# EAGLE board padaukprog (EAGLE 6.4), part 1 of 2
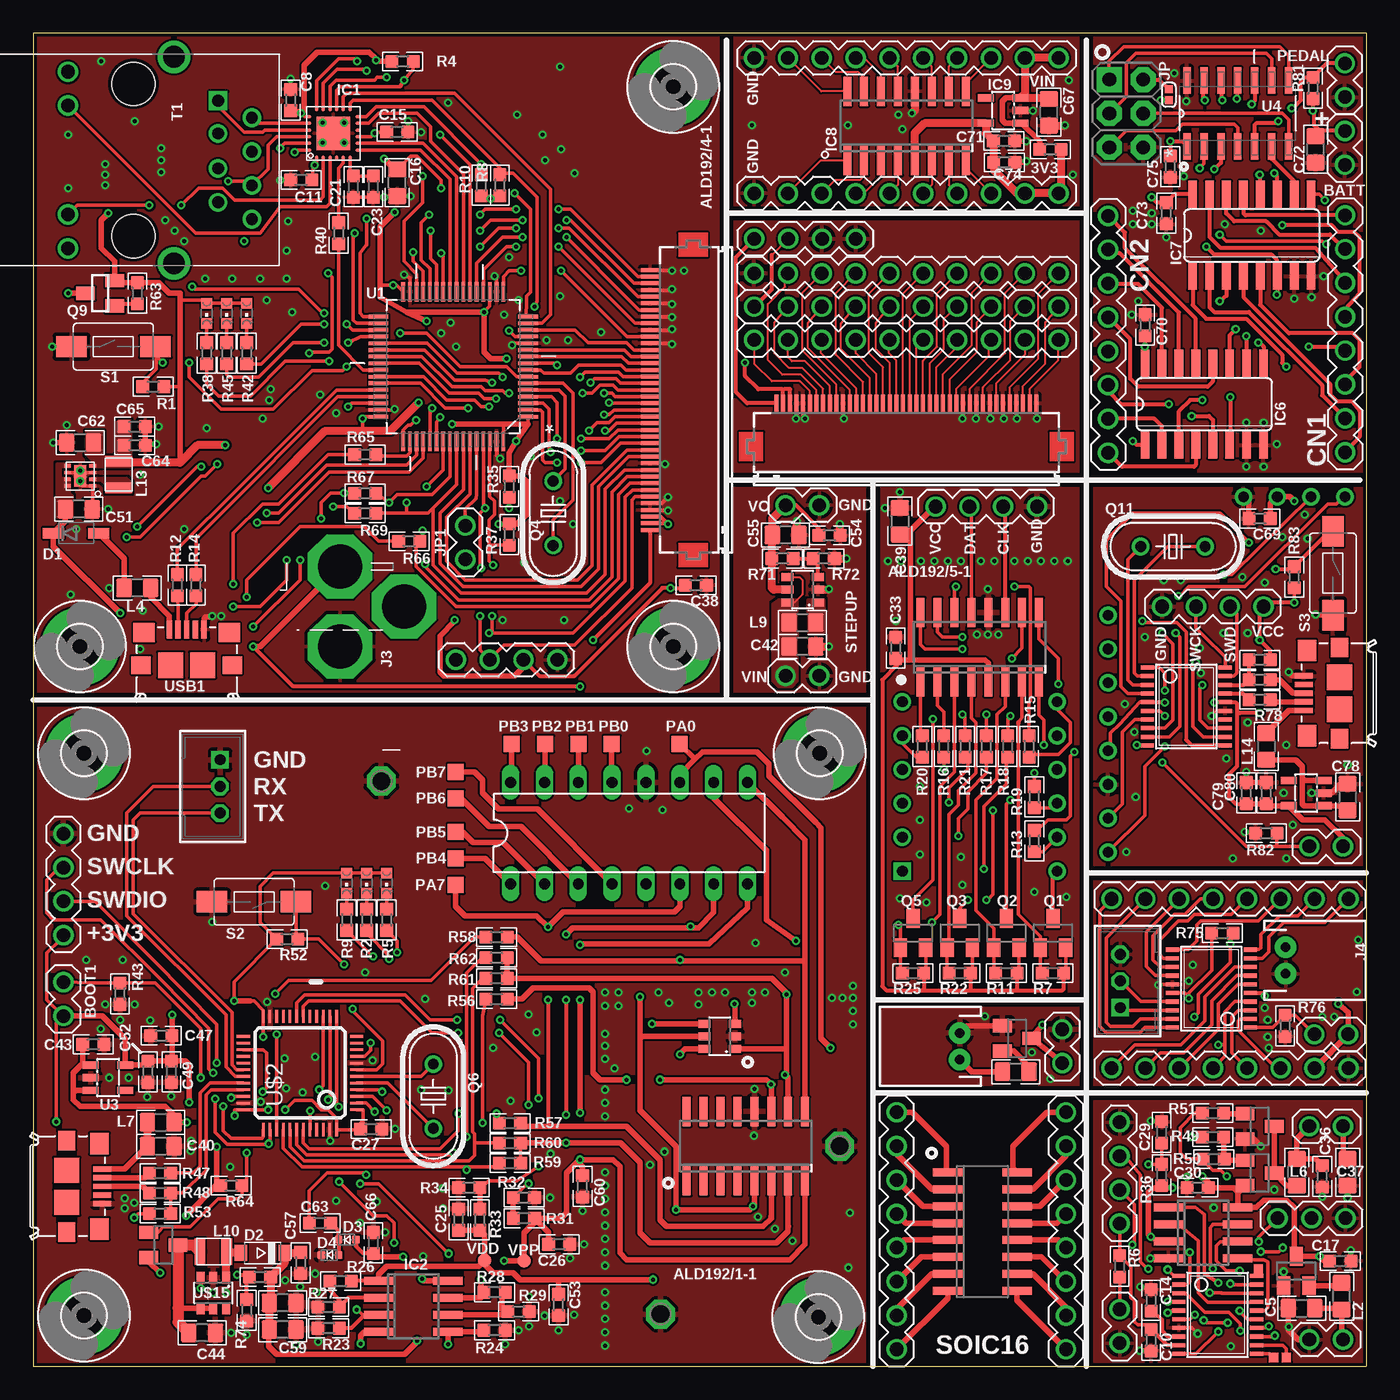
[diagram p8: board, top side]
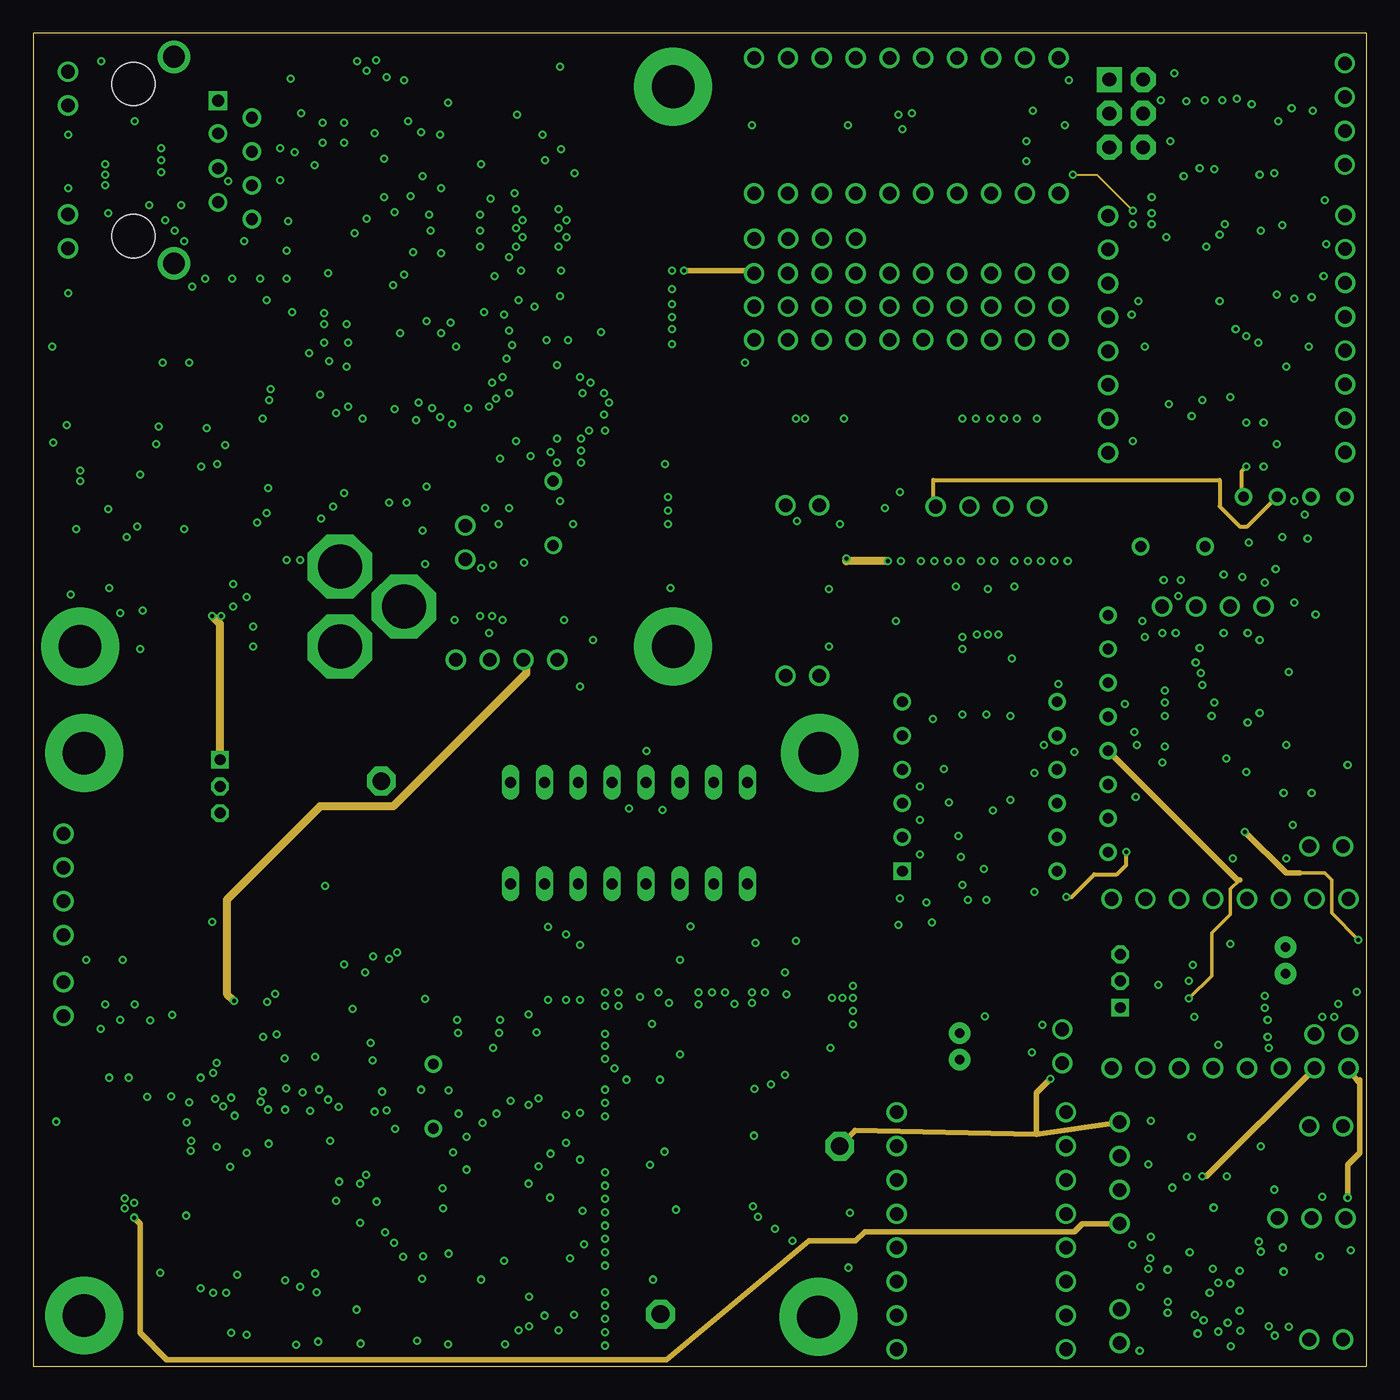
[diagram p9: board, inner layer Dummy]
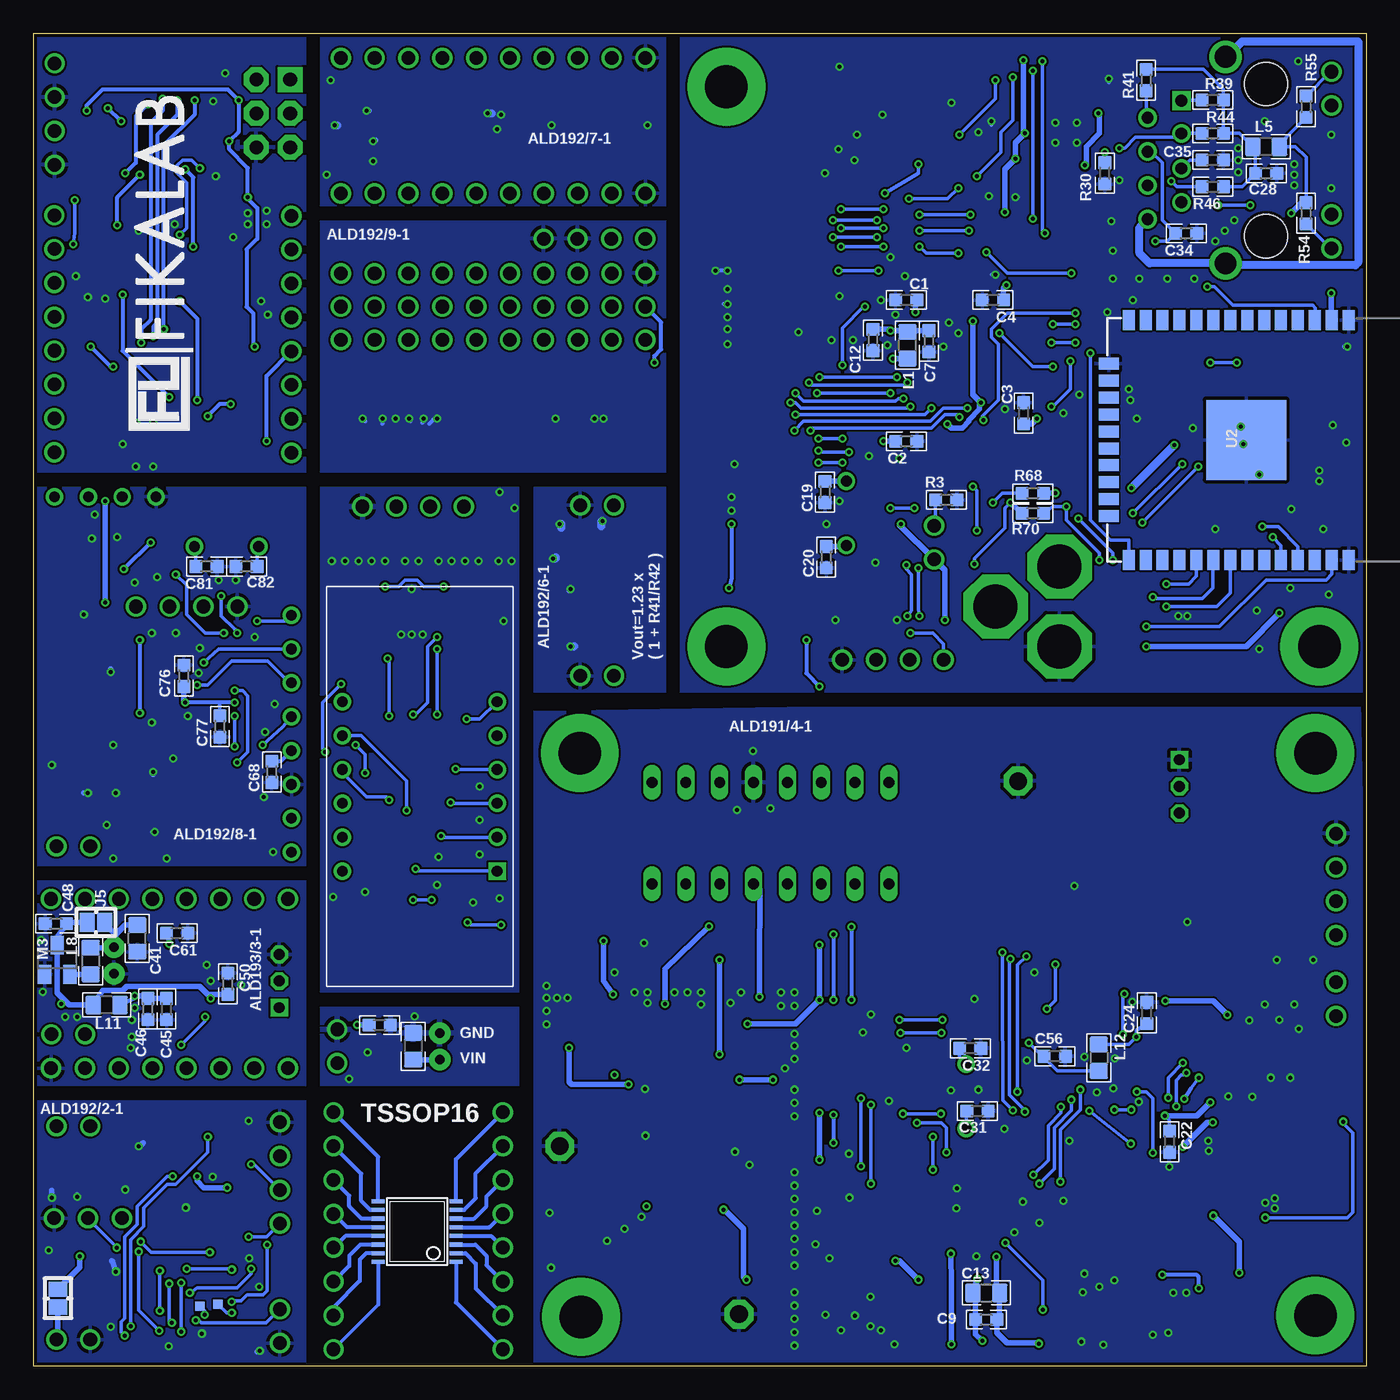
[diagram p10: board, bottom side, seen from below]

Size 100 x 100 mm. Coordinates in mm from the lower left corner, seen from the top.
Outline: 0,0 100,0 100,100 0,100 0,0
Copper layers (1*2*16): Top 0.035mm / dielectric 1.5mm / Dummy 0.0175mm / dielectric 1.1mm / Bottom 0.035mm
Design rules "JLCPCB-Single-DualLayer *": minimum track width 5mil, minimum drill 0.3mm, track to track 6mil, track to pad 6mil, pad to pad 6mil, via to via 6mil, smd to smd 0mil, copper to edge 10mil, drill to drill 10mil, minimum pad ring 10mil, minimum via ring 6mil, stop-mask expansion 2mil, vias tented up to drill 100mil, thermal gap 10mil
Net classes: 1 power: width 0.254 mm, drill 0.25 mm
tRestrict: area 62.5,0 to 63.5,67; area 63.5,20 to 100,21; area 78.5,0 to 79.5,21; area 78.5,21 to 79.5,100; area 79.5,36.5 to 108.5,37.5; area 0,49.5 to 63,50.5; area 49.5,50 to 50.5,50.5; area 62.5,66 to 100,67; area 63,27 to 78.5,28; area 52,86 to 78.5,87; area 51.5,50.5 to 52.5,100; area 52.5,66 to 62.5,67
bRestrict: area 62.5,0 to 63.5,67; area 63.5,20 to 100,21; area 78.5,0 to 79.5,20; area 78.5,21 to 79.5,100; area 79.5,36.5 to 108.5,37.5; area 0,49.5 to 63,50.5; area 49.5,50 to 50.5,50.5; area 62.5,66 to 100,67; area 63.5,27 to 78.5,28; area 52,86 to 78.5,87; area 51.5,50.5 to 52.5,100; area 52.5,66 to 62.5,67

## Footprints (pad centres in the part's own frame; a part is rotated, then mirrored left to right if it is on the bottom)
PIN-1X2 = drill 1.016: 1 -1.27,0; 2 1.27,0
0603 = smd 1 x 1: 1 -0.8,0; 2 0.8,0
0805 = smd 1.2 x 1.4: 1 -1,0; 2 1,0
SOD-123 = smd 1.6 x 0.8: 1 -1.7,0; 2 1.7,0
SOD-123' = smd 0.91 x 1.22: A 1.635,0; C -1.635,0
SOD523 = smd 0.6 x 0.6: A 0.7,0; K -0.6,0
3,2-PAD = drill 3.2 pad 5.842: B3,2 0,0
QFN24_4MM_X_4MM = smd 0.4 x 0.25: 1 -1.86,1.25; 2 -1.86,0.75; 3 -1.86,0.25; 4 -1.86,-0.25; 5 -1.86,-0.75; 6 -1.86,-1.25; 13 1.86,-1.25; 14 1.86,-0.75; 15 1.86,-0.25; 16 1.86,0.25; 17 1.86,0.75; 18 1.86,1.25 | smd 0.25 x 0.4: 7 -1.25,-1.86; 8 -0.75,-1.86; 9 -0.25,-1.86; 10 0.25,-1.86; 11 0.75,-1.86; 12 1.25,-1.86; 19 1.25,1.86; 20 0.75,1.86; 21 0.25,1.86; 22 -0.25,1.86; 23 -0.75,1.86; 24 -1.25,1.86 | smd 2.5 x 2.5: P 0,0
SO08 = smd 0.6 x 2.2: 1 -1.905,-2.6; 2 -0.635,-2.6; 3 0.635,-2.6; 4 1.905,-2.6; 5 1.905,2.6; 6 0.635,2.6; 7 -0.635,2.6; 8 -1.905,2.6
SOIC-16 = smd 0.6 x 2.2: 1 -4.445,-2.6; 2 -3.175,-2.6; 3 -1.905,-2.6; 4 -0.635,-2.6; 5 0.635,-2.6; 6 1.905,-2.6; 7 3.175,-2.6; 8 4.445,-2.6; 9 4.445,2.6; 10 3.175,2.6; 11 1.905,2.6; 12 0.635,2.6; 13 -0.635,2.6; 14 -1.905,2.6; 15 -3.175,2.6; 16 -4.445,2.6
WSON8-2.1X2.1 = smd 0.5 x 0.25: 1 -0.95,0.75; 2 -0.95,0.25; 3 -0.95,-0.25; 4 -0.95,-0.75; 5 0.95,-0.75; 6 0.95,-0.25; 7 0.95,0.25; 8 0.95,0.75 | smd 0.9 x 1.6: EXP 0,0
DIL16 = drill 0.813 long: 1 -8.89,-3.81; 2 -6.35,-3.81; 3 -3.81,-3.81; 4 -1.27,-3.81; 5 1.27,-3.81; 6 3.81,-3.81; 7 6.35,-3.81; 8 8.89,-3.81; 9 8.89,3.81; 10 6.35,3.81; 11 3.81,3.81; 12 1.27,3.81; 13 -1.27,3.81; 14 -3.81,3.81; 15 -6.35,3.81; 16 -8.89,3.81
SO16 = smd 0.66 x 2.032: 1 -4.445,-3.073; 2 -3.175,-3.073; 3 -1.905,-3.073; 4 -0.635,-3.073; 5 0.635,-3.073; 6 1.905,-3.073; 7 3.175,-3.073; 8 4.445,-3.073; 9 4.445,3.073; 10 3.175,3.073; 11 1.905,3.073; 12 0.635,3.073; 13 -0.635,3.073; 14 -1.905,3.073; 15 -3.175,3.073; 16 -4.445,3.073
SOIC16-N = smd 0.6 x 2.2: 1 -4.44,-2.645; 2 -3.17,-2.645; 3 -1.9,-2.645; 4 -0.63,-2.645; 5 0.64,-2.645; 6 1.91,-2.645; 7 3.18,-2.645; 8 4.45,-2.645; 9 4.45,2.555; 10 3.18,2.555; 11 1.91,2.555; 12 0.64,2.555; 13 -0.63,2.555; 14 -1.9,2.555; 15 -3.17,2.555; 16 -4.44,2.555
SOT23-5L = smd 0.55 x 1.2: 1 -0.95,-1.3; 2 0,-1.3; 3 0.95,-1.3; 4 0.95,1.3; 5 -0.95,1.3
JST-2-PTH@1 = drill 0.7 pad 1.6: 1 -1,0; 2 1,0
JUMPER_SOLDER_1X2 = smd 1.143 x 1.422: 1 -0.66,0; 2 0.66,0
SPC4078-NOSLOT = drill 3.302 pad 4.826 octagon: 1 -3,0; 2 0,-4.8; 3 3,0
2X3-NS = drill 1.016 pad 1.88 square: 1 -2.54,-1.27 | drill 1.016 pad 1.88 octagon: 2 -2.54,1.27; 3 0,-1.27; 4 0,1.27; 5 2.54,-1.27; 6 2.54,1.27
PIN-1X3 = drill 1.016: 1 -2.54,0; 2 0,0; 3 2.54,0
PIN-1X8 = drill 1.016: 1 -8.89,0; 2 -6.35,0; 3 -3.81,0; 4 -1.27,0; 5 1.27,0; 6 3.81,0; 7 6.35,0; 8 8.89,0
L2520 = smd 0.8 x 2: P$1 -1,0; P$2 1,0
LED-603 = smd 0.8 x 0.8: A 0,-0.75; C 0,0.75
SOT23 = smd 1 x 1.4: 1 -0.95,-1.1; 2 0.95,-1.1; 3 0,1.1
B3B-PH-K = drill 0.813 square: 1 -2,0 | drill 0.813 octagon: 2 0,0; 3 2,0
HC49U-V = drill 0.813: 1 -2.413,0; 2 2.413,0
SUPER-SOT3 = smd 1 x 1.4: 1 -0.95,-1.1; 2 0.95,-1.1; 3 0,1.1
TACTILE-SWITCH-1101NE = smd 2.3 x 1.6: P$1 -3.15,0; P$2 3.15,0
SJ_2S_SMALL = smd 0.6 x 0.6: 1 -0.4,0; 2 0.4,0
HR13550A = drill 0.89 square: 1 4.45,-6.35 | drill 0.89: 2 3.18,-8.89; 3 2,-6.35; 4 0.64,-8.89; 5 -0.63,-6.35; 6 -1.9,-8.89; 7 -3.17,-6.35; 8 -4.44,-8.89 | drill 1.02: 9 6.625,4.9; 10 4.085,4.9; 11 -4.085,4.9; 12 -6.625,4.9 | drill 1.63: Z1 -7.745,-3.05; Z2 7.745,-3.05 | hole 3.25: -5.715,0; 5.715,0
P1-13 = drill 1.321 pad 2.159 octagon: TP 0,0
TP07SQ = smd 0.7 x 0.7: TP 0,0
TP12SQ = smd 1.2 x 1.2: TP 0,0
QFP50P1200X1200X160-64N = smd 1.473 x 0.279: 1 -5.613,3.759; 2 -5.613,3.251; 3 -5.613,2.743; 4 -5.613,2.261; 5 -5.613,1.753; 6 -5.613,1.245; 7 -5.613,0.762; 8 -5.613,0.254; 9 -5.613,-0.254; 10 -5.613,-0.762; 11 -5.613,-1.245; 12 -5.613,-1.753; 13 -5.613,-2.261; 14 -5.613,-2.743; 15 -5.613,-3.251; 16 -5.613,-3.759; 33 5.613,-3.759; 34 5.613,-3.251; 35 5.613,-2.743; 36 5.613,-2.261; 37 5.613,-1.753; 38 5.613,-1.245; 39 5.613,-0.762; 40 5.613,-0.254; 41 5.613,0.254; 42 5.613,0.762; 43 5.613,1.245; 44 5.613,1.753; 45 5.613,2.261; 46 5.613,2.743; 47 5.613,3.251; 48 5.613,3.759 | smd 0.279 x 1.473: 17 -3.759,-5.613; 18 -3.251,-5.613; 19 -2.743,-5.613; 20 -2.261,-5.613; 21 -1.753,-5.613; 22 -1.245,-5.613; 23 -0.762,-5.613; 24 -0.254,-5.613; 25 0.254,-5.613; 26 0.762,-5.613; 27 1.245,-5.613; 28 1.753,-5.613; 29 2.261,-5.613; 30 2.743,-5.613; 31 3.251,-5.613; 32 3.759,-5.613; 49 3.759,5.613; 50 3.251,5.613; 51 2.743,5.613; 52 2.261,5.613; 53 1.753,5.613; 54 1.245,5.613; 55 0.762,5.613; 56 0.254,5.613; 57 -0.254,5.613; 58 -0.762,5.613; 59 -1.245,5.613; 60 -1.753,5.613; 61 -2.261,5.613; 62 -2.743,5.613; 63 -3.251,5.613; 64 -3.759,5.613
ESP-WROOM-32 = smd 0.9 x 1.5: 1 7.7,9; 2 6.43,9; 3 5.16,9; 4 3.89,9; 5 2.62,9; 6 1.35,9; 7 0.08,9; 8 -1.19,9; 9 -2.46,9; 10 -3.73,9; 11 -5,9; 12 -6.27,9; 13 -7.54,9; 14 -8.81,9; 25 -8.81,-9; 26 -7.54,-9; 27 -6.27,-9; 28 -5,-9; 29 -3.73,-9; 30 -2.46,-9; 31 -1.19,-9; 32 0.08,-9; 33 1.35,-9; 34 2.62,-9; 35 3.89,-9; 36 5.16,-9; 37 6.43,-9; 38 7.7,-9 | smd 1.5 x 0.9: 15 -10.3,5.715; 16 -10.3,4.445; 17 -10.3,3.175; 18 -10.3,1.905; 19 -10.3,0.635; 20 -10.3,-0.635; 21 -10.3,-1.905; 22 -10.3,-3.175; 23 -10.3,-4.445; 24 -10.3,-5.715 | smd 6 x 6: GND 0,0
SOIC127P600X175-14N = smd 1.981 x 0.559: 1 -2.464,3.81; 2 -2.464,2.54; 3 -2.464,1.27; 4 -2.464,0; 5 -2.464,-1.27; 6 -2.464,-2.54; 7 -2.464,-3.81; 8 2.464,-3.81; 9 2.464,-2.54; 10 2.464,-1.27; 11 2.464,0; 12 2.464,1.27; 13 2.464,2.54; 14 2.464,3.81
PIN-1X4 = drill 1.016: 1 -3.81,0; 2 -1.27,0; 3 1.27,0; 4 3.81,0
LQFP48 = smd 0.2 x 1: 1 -2.75,-4.25; 2 -2.25,-4.25; 3 -1.75,-4.25; 4 -1.25,-4.25; 5 -0.75,-4.25; 6 -0.25,-4.25; 7 0.25,-4.25; 8 0.75,-4.25; 9 1.25,-4.25; 10 1.75,-4.25; 11 2.25,-4.25; 12 2.75,-4.25; 25 2.75,4.25; 26 2.25,4.25; 27 1.75,4.25; 28 1.25,4.25; 29 0.75,4.25; 30 0.25,4.25; 31 -0.25,4.25; 32 -0.75,4.25; 33 -1.25,4.25; 34 -1.75,4.25; 35 -2.25,4.25; 36 -2.75,4.25 | smd 1 x 0.2: 13 4.25,-2.75; 14 4.25,-2.25; 15 4.25,-1.75; 16 4.25,-1.25; 17 4.25,-0.75; 18 4.25,-0.25; 19 4.25,0.25; 20 4.25,0.75; 21 4.25,1.25; 22 4.25,1.75; 23 4.25,2.25; 24 4.25,2.75; 37 -4.25,2.75; 38 -4.25,2.25; 39 -4.25,1.75; 40 -4.25,1.25; 41 -4.25,0.75; 42 -4.25,0.25; 43 -4.25,-0.25; 44 -4.25,-0.75; 45 -4.25,-1.25; 46 -4.25,-1.75; 47 -4.25,-2.25; 48 -4.25,-2.75
LCD_7SEG_4DIGIT = drill 0.8 square: 1 -6.35,-5.8 | drill 0.8: 2 -3.81,-5.8; 3 -1.27,-5.8; 4 1.27,-5.8; 5 3.81,-5.8; 6 6.35,-5.8; 7 6.35,5.8; 8 3.81,5.8; 9 1.27,5.8; 10 -1.27,5.8; 11 -3.81,5.8; 12 -6.35,5.8
TSSOP20 = smd 0.305 x 0.991: 1 -2.925,-2.918; 2 -2.275,-2.918; 3 -1.625,-2.918; 4 -0.975,-2.918; 5 -0.325,-2.918; 6 0.325,-2.918; 7 0.975,-2.918; 8 1.625,-2.918; 9 2.275,-2.918; 10 2.925,-2.918; 11 2.925,2.918; 12 2.275,2.918; 13 1.625,2.918; 14 0.975,2.918; 15 0.325,2.918; 16 -0.325,2.918; 17 -0.975,2.918; 18 -1.625,2.918; 19 -2.275,2.918; 20 -2.925,2.918
SOIC8 = smd 0.6 x 2.2: 1 -1.905,-2.6; 2 -0.635,-2.6; 3 0.635,-2.6; 4 1.905,-2.6; 5 1.905,2.6; 6 0.635,2.6; 7 -0.635,2.6; 8 -1.905,2.6
TSSOP16 = smd 0.305 x 0.991: 1 -2.275,-2.918; 2 -1.625,-2.918; 3 -0.975,-2.918; 4 -0.325,-2.918; 5 0.325,-2.918; 6 0.975,-2.918; 7 1.625,-2.918; 8 2.275,-2.918; 9 2.275,2.918; 10 1.625,2.918; 11 0.975,2.918; 12 0.325,2.918; 13 -0.325,2.918; 14 -0.975,2.918; 15 -1.625,2.918; 16 -2.275,2.918
SOT23-6 = smd 0.6 x 0.9: 1 -0.95,-1.15; 2 0,-1.15; 3 0.95,-1.15; 4 0.95,1.15; 5 0,1.15; 6 -0.95,1.15
PIN-1X10 = drill 1.016: 1 -11.43,0; 2 -8.89,0; 3 -6.35,0; 4 -3.81,0; 5 -1.27,0; 6 1.27,0; 7 3.81,0; 8 6.35,0; 9 8.89,0; 10 11.43,0
HW-147-NFC-NOHOLES = drill 0.8: GND 6.35,13.97; GND1 -15.24,3.81; IRQ 8.89,13.97; MISO -3.81,13.97; MOSI -1.27,13.97; RSTO 11.43,13.97; SCK -6.35,13.97; SCL/RX -15.24,-3.81; SDA/TX -15.24,-1.27; SS 1.27,13.97; VCC 3.81,13.97; VCC1 -15.24,1.27
CONN_USB_MICRO-B = smd 1.6 x 1.4: BODY@1 -3.2,2.45; BODY@2 3.2,2.45 | smd 1.45 x 1.3: BODY@3 3.425,0; BODY@6 -3.425,0 | smd 1.9 x 1.9: BODY@4 1.2,0; BODY@5 -1.2,0 | smd 0.4 x 1.35: P1 -1.3,2.675; P2 -0.65,2.675; P3 0,2.675; P4 0.65,2.675; P5 1.3,2.675
TP10R = smd 1 x 1: TP 0,0
FH12-40S-0.5SH = smd 0.3 x 1.3: 1 -9.75,3.25; 2 -9.25,3.25; 3 -8.75,3.25; 4 -8.25,3.25; 5 -7.75,3.25; 6 -7.25,3.25; 7 -6.75,3.25; 8 -6.25,3.25; 9 -5.75,3.25; 10 -5.25,3.25; 11 -4.75,3.25; 12 -4.25,3.25; 13 -3.75,3.25; 14 -3.25,3.25; 15 -2.75,3.25; 16 -2.25,3.25; 17 -1.75,3.25; 18 -1.25,3.25; 19 -0.75,3.25; 20 -0.25,3.25; 21 0.25,3.25; 22 0.75,3.25; 23 1.25,3.25; 24 1.75,3.25; 25 2.25,3.25; 26 2.75,3.25; 27 3.25,3.25; 28 3.75,3.25; 29 4.25,3.25; 30 4.75,3.25; 31 5.25,3.25; 32 5.75,3.25; 33 6.25,3.25; 34 6.75,3.25; 35 7.25,3.25; 36 7.75,3.25; 37 8.25,3.25; 38 8.75,3.25; 39 9.25,3.25; 40 9.75,3.25

## Placement (x,y rotation side)
BOOT1  PIN-1X2  [PIN-1X2]  2.25,27.55 270 top
BOOT2  PIN-1X2  [PIN-1X2]  97,39 0 top
C1  100nF 6.3V  [0603]  34.5,80 180 bottom
C2  100nF 6.3V  [0603]  34.5,69.4 0 bottom
C3  100nF 6.3V  [0603]  25.7,71.5 90 bottom
C4  100nF 6.3V  [0603]  28,80 180 bottom
C5  22uF 16V  [0805]  95.15,4.35 0 top
C6  22uF 16V  [0805]  71.5,24 270 bottom
C7  100nF 6.3V  [0603]  32.8,76.9 270 bottom
C8  100nF  [0603]  19.3,95 270 top
C9  100nF 50V  [0603]  28.5,3.5 0 bottom
C10  100nF  [0603]  83.85,1.95 90 top
C11  100nF  [0603]  20.1,89 0 top
C12  10uF  [0603]  37,77 90 bottom
C13  2.2uF 50V  [0805]  28.5,5.5 0 bottom
C14  2.2uF  [0603]  83.85,4.95 270 top
C15  100nF  [0603]  27.3,92.6 180 top
C16  2.2uF  [0805]  27.3,88.8 90 top
C17  10uF  [0603]  98.05,7.9 180 top
C18  10uF  [0603]  74,25.6 180 bottom
C19  16pF 6.3V  [0603]  40.6,65.6 90 bottom
C20  16pF 6.3V  [0603]  40.5,60.7 90 bottom
C21  1uF  [0603]  24,88.5 90 top
C22  100nF 6.3V  [0603]  14.75,16.85 270 bottom
C23  1nF  [0603]  25.5,88.5 90 top
C24  100nF 6.3V  [0603]  16.45,26.5 90 bottom
C25  100nF 50V  [0603]  31.9,11 90 top
C26  100nF 50V  [0603]  39.45,9.15 0 top
C27  100nF 6.3V  [0603]  25.35,17.8 0 top
C28  100nF/DNP  [0603]  7.5,89.5 180 bottom
C29  100nF  [0603]  84.65,17.55 270 top
C30  100nF  [0603]  87.35,13.4 0 top
C31  20pF 6.3V  [0603]  29.15,19.15 180 bottom
C32  20pF 6.3V  [0603]  29.7,23.85 180 bottom
C33  100nF  [0603]  64.7,53.9 270 top
C34  100nF  [0603]  13.5,85 0 bottom
C35  100nF  [0603]  11.5,90.5 0 bottom
C36  1uF  [0603]  96.7,14.25 90 top
C37  10uF  [0805]  98.6,14.55 90 top
C38  10uF  [0603]  49.7,58.6 180 top
C39  22uF  [0805]  65,63.4 270 top
C40  22uF  [0805]  9.55,16.5 180 top
C41  22uF 16V  [0805]  92.2,32.1 90 bottom
C42  10uF  [0805]  57.7,54 180 top
C43  10uF 6.3V  [0603]  4.5,24.15 0 top
C44  22uF 16V  [0805]  12.65,2.5 180 top
C45  100nF  [0603]  90,26.8 90 bottom
C46  1uF  [0603]  91.4,26.8 90 bottom
C47  100nF 6.3V  [0603]  9.6,24.8 180 top
C48  10uF  [0603]  98.3,33.2 0 bottom
C49  10uF 6.3V  [0603]  10.35,22.1 270 top
C50  100nF  [0603]  85.4,28.7 270 bottom
C51  10uF  [0805]  3.4,64.3 180 top
C52  10uF 6.3V  [0603]  8.6,22.1 270 top
C53  100nF 50V  [0603]  39.4,4.6 270 top
C54  100nF  [0603]  59.74,62.34 180 top
C55  10uF  [0805]  56.44,62.36 180 top
C56  100nF 6.3V  [0603]  23.35,23.25 0 bottom
C57  100nF 50V  [0603]  20.05,7.75 270 top
C58  22uF 50V  [0805]  18.7,4.75 180 top
C59  22uF 50V  [0805]  18.7,2.75 180 top
C60  100nF 50V  [0603]  41.2,13.5 270 top
C61  1uF  [0603]  89.2,32.5 180 bottom
C62  10uF  [0805]  3.5,69.3 0 top
C63  100nF 50V  [0603]  21.5,10.75 0 top
C64  100nF  [0603]  7.6,69.1 180 top
C65  10nF  [0603]  7.6,70.5 180 top
C66  100nF 50V  [0603]  25.5,9.25 90 top
C67  22uF  [0805]  76.2,94.08 90 top
C68  100nF  [0603]  82.1,44.6 90 bottom
C69  100nF  [0603]  92,63.6 0 top
C70  100nF  [0603]  83.4,78.1 90 top
C71  100nF  [0603]  72.83,91.93 180 top
C72  10uF  [0805]  96.2,91.3 90 top
C73  100nF  [0603]  85,86.5 270 top
C74  100nF  [0603]  72.84,90.33 180 top
C75  100nF  [0603]  85.3,90 270 top
C76  100nF  [0603]  88.7,51.8 270 bottom
C77  100nF  [0603]  86,48 90 bottom
C78  10uF  [0805]  98.6,42.7 270 top
C79  10nF  [0603]  91,43 270 top
C80  100nF  [0603]  92.5,43 270 top
C81  20pF 6.3V  [0603]  87,60 180 bottom
C82  20pF 6.3V  [0603]  84,60 0 bottom
D1  1N4148W  [SOD-123]  3.2,62.5 0 top
D2  2SS100L-W  [SOD-123']  17.2,8.5 180 top
D3  RB521S-30  [SOD523]  23.5,9.5 0 top
D4  RB521S-30  [SOD523]  22.2,8.35 0 top
H1  MOUNT-PAD-ROUND3.2  [3,2-PAD]  3.5,54 0 top
H2  MOUNT-PAD-ROUND3.2  [3,2-PAD]  48,96 0 top
H3  MOUNT-PAD-ROUND3.2  [3,2-PAD]  48,54 0 top
H4  MOUNT-PAD-ROUND3.2  [3,2-PAD]  59,46 0 top
H5  MOUNT-PAD-ROUND3.2  [3,2-PAD]  58.9,3.7 0 top
H6  MOUNT-PAD-ROUND3.2  [3,2-PAD]  3.8,46 0 top
H7  MOUNT-PAD-ROUND3.2  [3,2-PAD]  3.8,3.8 0 top
IC1  LAN8720A  [QFN24_4MM_X_4MM]  22.5,92.5 90 top
IC2  LM358D  [SO08]  28.5,4.5 270 top
IC3  IC_DIL16-SOIC-16  [SOIC-16]  71.2,10.1 270 top
IC4  TPS62063  [WSON8-2.1X2.1]  3.5,66.8 180 top
IC5  [DIL16]  44.69,40 0 top
IC6  4051D  [SO16]  87.85,72.19 0 top
IC7  4051D  [SO16]  91.42,84.85 0 top
IC8  PFS154-S16  [SOIC16-N]  65.5,93.1 0 top
IC9  MIC550X  [SOT23-5L]  72.76,94.21 90 top
J1  JST-PH 2mm  [JST-2-PTH@1]  69.5,24 90 top
J2  JUMPER_SOLDER_1X2  [JUMPER_SOLDER_1X2]  98.15,5.1 90 bottom
J3  [SPC4078-NOSLOT]  23,57 90 top
J4  JST-PH 2mm  [JST-2-PTH@1]  93.95,30.45 270 top
J5  JUMPER_SOLDER_1X2  [JUMPER_SOLDER_1X2]  95.3,33.3 180 bottom
J6  AVR_SPI_PRG_6NS  [2X3-NS]  82,94 270 top
JP1  PIN-1X2  [PIN-1X2]  32.4,61.8 270 top
JP2  PIN-1X2  [PIN-1X2]  81.5,3 90 top
JP3  PIN-1X2  [PIN-1X2]  97,2 0 top
JP4  PIN-1X3  [PIN-1X3]  95.9,11.1 180 top
JP5  PIN-1X2  [PIN-1X2]  77.2,24 90 top
JP6  PIN-1X2  [PIN-1X2]  97,18 0 top
JP7  PIN-1X2  [PIN-1X2]  57.7,51.8 180 top
JP8  PIN-1X2  [PIN-1X2]  57.7,64.6 0 top
JP9  PIN-1X2  [PIN-1X2]  97.38,24.9 180 top
JP10  VBat +  [PIN-1X2]  98.4,91.42 90 top
JP11  Pedal  [PIN-1X2]  98.4,96.49 90 top
JP12  PIN-1X8  [PIN-1X8]  80.64,77.43 90 top
JP13  PIN-1X8  [PIN-1X8]  98.42,77.47 90 top
L1  10uH  [0805]  34.4,76.6 90 bottom
L2  10uH  [0805]  98.15,5.25 90 top
L3  10uH  [0805]  73.7,22.1 0 top
L4  600R  [0805]  7.8,58.4 180 top
L5  600R  [0805]  7.5,91.5 180 bottom
L6  150nH  [0805]  94.8,14.55 90 top
L7  600R  [0805]  9.55,18.3 0 top
L8  10uH  [0805]  95.7,30.4 270 bottom
L9  10uH  [0805]  57.7,55.8 0 top
L10  DFE252012F  [L2520]  13.5,8.6 0 top
L11  600R  [0805]  94.5,27.1 180 bottom
L12  600R  [0805]  20.05,23.15 270 bottom
L13  DFE252012F  [L2520]  6.4,66.9 90 top
L14  600R  [0805]  92.5,46.5 270 top
LED1  LG L29K-G2J1-24  [LED-603]  25,36.25 180 top
LED2  LG L29K-G2J1-24  [LED-603]  26.5,36.25 180 top
LED3  LG L29K-G2J1-24  [LED-603]  23.5,36.25 180 top
LED4  LG L29K-G2J1-24  [LED-603]  13,79 180 top
LED5  LG L29K-G2J1-24  [LED-603]  16,79 180 top
LED6  LG L29K-G2J1-24  [LED-603]  14.5,79 180 top
M1  XT1861B  [SOT23]  94.75,7.15 0 top
M2  XT1861B  [SOT23]  73.8,24.6 270 top
M3  XT1861B  [SOT23]  98.2,30.5 0 bottom
P1  B3B-PH-K  [B3B-PH-K]  14,43.5 270 top
P2  B3B-PH-K  [B3B-PH-K]  81.55,28.9 90 top
Q1  BSS84  [SOT23]  76.5,32.5 0 top
Q2  BSS84  [SOT23]  73,32.5 0 top
Q3  BSS84  [SOT23]  69.5,32.5 0 top
Q4  25MHz  [HC49U-V]  39,64 90 top
Q5  BSS84  [SOT23]  66,32.5 0 top
Q6  8MHz  [HC49U-V]  30,20.25 270 top
Q7  BSS84  [SOT23]  92,14.5 270 top
Q8  BSS123  [SOT23]  92,18 270 top
Q9  FDN338  [SUPER-SOT3]  5,80.5 90 top
Q10  BSS84  [SOT23]  9.75,9.1 270 top
Q11  8MHz  [HC49U-V]  85.5,61.5 0 top
R1  470K  [0603]  9,73.5 180 top
R2  2K2  [0603]  25,33.5 270 top
R3  10K  [0603]  31.5,65 0 bottom
R4  10K  [0603]  27.7,97.9 180 top
R5  2K2  [0603]  26.5,33.5 270 top
R6  10K  [0603]  81.5,7.5 90 top
R7  10K  [0603]  76.5,29.5 0 top
R8  2K2  [0603]  35,88.6 270 top
R9  2K2  [0603]  23.5,33.5 270 top
R10  2K2  [0603]  33.6,88.6 270 top
R11  10K  [0603]  73,29.5 0 top
R12  20R  [0603]  10.8,58.6 90 top
R13  330R  [0603]  75.1,39.4 270 top
R14  20R  [0603]  12.2,58.6 90 top
R15  330R  [0603]  74.7,46.5 270 top
R16  330R  [0603]  68.3,46.5 270 top
R17  330R  [0603]  71.5,46.5 270 top
R18  330R  [0603]  73.1,46.5 270 top
R19  330R  [0603]  75.1,42.7 270 top
R20  330R  [0603]  66.7,46.5 270 top
R21  330R  [0603]  69.9,46.5 270 top
R22  10K  [0603]  69.5,29.5 0 top
R23  240K  [0603]  22.15,2.85 0 top
R24  240K  [0603]  34.6,2.7 180 top
R25  10K  [0603]  66,29.5 0 top
R26  20K  [0603]  23.05,6.4 180 top
R27  20K  [0603]  22.15,4.45 0 top
R28  20K  [0603]  34.6,5.55 0 top
R29  6K2  [0603]  36.4,4.1 180 top
R30  12K1  [0603]  19.6,89.5 90 bottom
R31  100K  [0603]  36.8,11.1 0 top
R32  20K  [0603]  36.8,12.65 180 top
R33  100K  [0603]  33.5,11 270 top
R34  20K  [0603]  32.7,13.4 0 top
R35  2K2/DNP  [0603]  35.7,66 90 top
R36  10K  [0603]  84.65,14.35 270 top
R37  2K2/DNP  [0603]  35.7,62.4 90 top
R38  2K2  [0603]  13,76 270 top
R39  49R9  [0603]  11.5,95 0 bottom
R40  0R  [0603]  22.9,85 90 top
R41  49R9  [0603]  16.5,96.5 90 bottom
R42  2K2  [0603]  16,76 270 top
R43  10K  [0603]  6.5,27.95 90 top
R44  49R9  [0603]  11.5,92.5 0 bottom
R45  2K2  [0603]  14.5,76 270 top
R46  49R9  [0603]  11.5,88.5 0 bottom
R47  20R  [0603]  9.5,14.5 0 top
R48  20R  [0603]  9.5,13 0 top
R49  0R/DNP  [0603]  88.5,17.2 180 top
R50  100R  [0603]  88.55,15.55 180 top
R51  100R  [0603]  88.5,19 180 top
R52  10K  [0603]  19.05,32.05 180 top
R53  1K5/DNP  [0603]  9.5,11.45 180 top
R54  330R  [0603]  4.5,86.5 90 bottom
R55  330R  [0603]  4.5,94.5 270 bottom
R56  100R  [0603]  34.75,27.55 180 top
R57  100R  [0603]  35.75,18.25 180 top
R58  100R  [0603]  34.75,32.2 180 top
R59  100R  [0603]  35.75,15.25 180 top
R60  100R  [0603]  35.75,16.75 180 top
R61  100R  [0603]  34.75,29.1 180 top
R62  100R  [0603]  34.75,30.65 180 top
R63  100K  [0603]  7.8,80.5 270 top
R64  6K2  [0603]  14.85,13.55 180 top
R65  0R  [0603]  24.9,68.4 180 top
R66  0R  [0603]  28.2,61.9 180 top
R67  0R  [0603]  24.9,65.5 180 top
R68  0R/DNP  [0603]  25,65.5 0 bottom
R69  0R  [0603]  24.9,64 180 top
R70  0R/DNP  [0603]  25,64 0 bottom
R71  1K5/DNP  [0603]  56.2,60.6 180 top
R72  1K5/DNP  [0603]  59.3,60.6 180 top
R73  240K  [0603]  17,6.7 0 top
R74  10K  [0603]  16,4.2 90 top
R75  10K  [0603]  89.2,32.5 180 top
R76  10K  [0603]  93.92,25.53 90 top
R77  1K5/DNP  [0603]  76.3,91.3 0 top
R78  20R  [0603]  92,50 180 top
R79  20R  [0603]  92,51.5 180 top
R80  1K5/DNP  [0603]  92,53 0 top
R81  10K  [0603]  96,95.9 270 top
R82  10K  [0603]  92.5,40 0 top
R83  10K  [0603]  94.6,59.2 270 top
S1  SWITCHES_-SMD-1101NE  [TACTILE-SWITCH-1101NE]  6,76.5 0 top
S2  SWITCHES_-SMD-1101NE  [TACTILE-SWITCH-1101NE]  16.55,34.85 180 top
S3  SWITCHES_-SMD-1101NE  [TACTILE-SWITCH-1101NE]  97.5,59.5 270 top
SJ1  SOLDERJUMPERNC  [SJ_2S_SMALL]  85.2,95.4 90 top
T1  Hanrun HR917550A  [HR13550A]  7.5,90.5 90 top
TP11  TPPAD1-13  [P1-13]  60.5,16.5 0 top
TP12  TPPAD1-13  [P1-13]  26.1,43.9 0 top
TP13  TPPAD1-13  [P1-13]  47.05,3.9 0 top
TP14  TPTP07SQ  [TP07SQ]  91.9,7.3 0 top
TP15  TPTP07SQ  [TP07SQ]  94,0.65 0 top
TP16  TPTP07SQ  [TP07SQ]  93.05,0.65 0 top
TP17  TPTP07SQ  [TP07SQ]  86.15,4.65 0 bottom
TP18  TPTP07SQ  [TP07SQ]  87.5,4.5 0 bottom
TP20  TPTP12SQ  [TP12SQ]  43.39,46.7 0 top
TP21  TPTP12SQ  [TP12SQ]  40.89,46.7 0 top
TP22  TPTP12SQ  [TP12SQ]  38.39,46.7 0 top
TP23  TPTP12SQ  [TP12SQ]  35.89,46.7 0 top
TP24  TPTP12SQ  [TP12SQ]  31.69,38.1 0 top
TP25  TPTP12SQ  [TP12SQ]  31.69,40.1 0 top
TP26  TPTP12SQ  [TP12SQ]  31.69,42.6 0 top
TP27  TPTP12SQ  [TP12SQ]  31.69,44.6 0 top
TP28  TPTP12SQ  [TP12SQ]  48.49,46.7 0 top
TP29  TPTP12SQ  [TP12SQ]  31.69,36.1 0 top
U1  STM32F107RCT6  [QFP50P1200X1200X160-64N]  31.5,75 180 top
U2  ESP-WROOM-32  [ESP-WROOM-32]  9,69.5 0 bottom
U3  MIC550X  [SOT23-5L]  5.6,21.65 270 top
U4  ATTINY24A-SSU  [SOIC127P600X175-14N]  90.36,94 90 top
U$1  PIN-1X4  [PIN-1X4]  2.25,36.15 90 top
U$2  STM32F072CBT6  [LQFP48]  20,22 90 top
U$3  SR410361N  [LCD_7SEG_4DIGIT]  71,43.5 90 bottom
U$4  STM8S003F3P6  [TSSOP20]  88.85,3.85 270 top
U$5  P25QXH  [SOIC8]  87.75,10 270 top
U$6  PIN-1X8  [PIN-1X8]  64.77,10.16 90 top
U$7  PFS154-S16  [SOIC16-N]  71,54 0 top
U$8  PIN-1X4  [PIN-1X4]  81.5,14.5 90 top
U$9  TSSOP16  [TSSOP16]  71.2,10.1 90 bottom
U$10  PIN-1X4  [PIN-1X4]  71.5,64.5 180 top
U$11  PIN-1X8  [PIN-1X8]  77.47,10.16 90 top
U$12  PIN-1X4  [PIN-1X4]  57.9,84.6 0 top
U$13  PMS150C-U06  [SOT23-6]  51.5,24.75 90 top
U$14  AP2000  [SOT23-6]  57.71,58.26 90 top
U$15  MT3608  [SOT23-6]  13.5,5.5 180 top
U$16  PIN-1X10  [PIN-1X10]  65.5,77 0 top
U$17  PIN-1X10  [PIN-1X10]  65.5,79.5 0 top
U$18  PIN-1X10  [PIN-1X10]  65.5,82 0 top
U$19  STM32F030F4P6  [TSSOP20]  88.38,28.33 90 top
U$20  PFS154-S16  [SOIC16-N]  53.45,16.55 0 top
U$21  PIN-1X8  [PIN-1X8]  89.78,35.06 0 top
U$22  PIN-1X4  [PIN-1X4]  35.5,53 180 top
U$23  PIN-1X8  [PIN-1X8]  89.78,22.36 0 top
U$24  [FIKALAB-25X5]  88,70 90 bottom
U$25  PN532_NFCB  [HW-147-NFC-NOHOLES]  94.6,50 270 bottom
U$26  PIN-1X10  [PIN-1X10]  65.5,88 0 top
U$27  PIN-1X10  [PIN-1X10]  65.5,98.16 0 top
U$28  MIC550X  [SOT23-5L]  95.5,43 90 top
U$29  STM32F070F6  [TSSOP20]  86.5,49.5 270 top
U$30  PIN-1X4  [PIN-1X4]  88.5,57 180 top
USB1  CON-USB-F-MICRO-B  [CONN_USB_MICRO-B]  11.5,52.6 0 top
USB2  CON-USB-F-MICRO-B  [CONN_USB_MICRO-B]  2.5,13.5 270 top
USB3  CON-USB-F-MICRO-B  [CONN_USB_MICRO-B]  98,50.5 90 top
VDD  TPTP10R  [TP10R]  33.85,7.95 0 top
VPP  TPTP10R  [TP10R]  36.8,7.9 0 top
X1  FH12-40S-0.5SH  [FH12-40S-0.5SH]  49.5,72.5 90 top
X2  FH12-40S-0.5SH  [FH12-40S-0.5SH]  65.5,69 0 top

## Tracks (layer width: path | path; a pad name or v marks a point on that pad's centre or on a via)
+3V3  (via drill 0.3, 0.3 pad 0.25)
  Top 0.254: v18.9,19.25 19.6,19.95 20.9,19.95 21.6,19.25 22.1,19.25 22.75,18.6 U$2.48 24.05,17.75 24.75,18.45 | U$2.1 24.75,19.25 24.75,18.45 | v17.6,19.25 U$2.36 15.1,19.25 v15.1,18.8 | 16.25,27.4 16.55,27.4 17.25,26.7 U$2.24 v17.25,24.7 | 24.75,18.45 24.75,18 C27.1 | R53.2 7.85,11.45 v7.55,11.15 | v1.7,18.35 1.7,25.73 BOOT1.2 2.22,26.28 1,27.5 1,31 2,32 U$1.1 | v15.05,27.4 15.05,28.85 R52.2 17,33.3 17,36 18,37 LED3.A LED1.A LED2.A | C10.2 83.85,3.1 82.85,3.1 82.6,3.35 82.6,4.9 82.35,5.15 82.35,7.45 R6.2 U$8.1 | U$5.3 84.19,9.37 v83.85,9.7 | U$19.16 85.89,28 86.4,28 86.7,27.7 v86.7,27.6 86.7,28 88.4,29.7 R75.2 | IC1.19 20.35,93.75 v20.1,94 19.9,94.2 C8.2 | IC1.1 21.25,90.25 v21.1,90.1 21,90 C11.2 | IC1.9 25.35,92.25 v25.6,92.5 25.7,92.6 C15.2 | U1.19 34.24,79.54 v33.8,79.1 | U1.48 24.84,71.24 v24.7,71.1 24.7,70.2 | U1.64 35.26,70.74 37.1,70.7 | U1.1 37.11,70.81 37,70.7 | U1.32 27.25,81.1 v27,81.1 26,81.1 | 25.8,97.9 v25.7,98 | R1.1 10.9,73.5 11,73.4 | LED5.A LED6.A LED4.A | LED4.A 13,79.5 | LED4.A 13,80 11,80 | U$29.5 83.03,49.83 81.5,48.2 80.8,47.5 80.8,46.46 U$25.VCC | R83.2 v94.6,57.3 | Q1.2 77.45,29.65 R7.2 | Q2.2 73.95,29.65 R11.2 | Q3.2 70.45,29.65 R22.2 | Q5.2 66.95,29.65 R25.2 | C39.2 65.7,62.4 65.8,62.5 | R8.2 R10.2 34.1,87.8 v34.3,87.6 | v30.6,88.4 30.6,89 28.8,90.8 28.3,90.8 C16.2
  Top 0.305: U$4.9 85.08,1.57 84.15,2.5 C10.2 | U$29.5 84.88,49.83 v84.9,49.8 | v88.6,49.8 88.62,49.83 U$29.16 90.17,49.83 90.3,49.7 90.3,49.1 | 90.3,49.1 90.3,45 89.7,44.4 89.7,42.7 90.2,42.2 C79.2 | R80.2 92.8,53.7 v92,54.5 92,56.69 U$30.1 92.61,57.3 v94.6,57.3 | v92,49 90.5,49 90.3,49.1 | 64.8,53 64.8,52.6 63.7,51.5 63.7,28.5 64,28.2 66.7,28.2 | 66.7,28.2 70.3,28.2 | 70.3,28.2 73.7,28.2 | 73.7,28.2 77.2,28.2 77.3,28.3 R7.2 | R11.2 73.8,28.3 73.7,28.2 | R22.2 70.3,28.2 | R25.2 66.8,28.3 66.7,28.2 | X1.3 47.05,63.75 v47.6,63.2 47.55,63.25 X1.2 | C38.2 48.9,58.4 v47.8,58.4 47.2,58.4 40.6,51.8 37.97,51.8 U$22.2
  Top 0.406: v11.7,19.8 11.7,22.6 11.4,22.9 C49.1 | C49.1 C52.1 8.65,22.6 U3.5 6.9,24.55 5.17,26.28 BOOT1.2 | C49.1 10.4,22.95 C47.1 v10.4,26.35 | 16.25,27.4 v15.05,27.4 | 90.4,13.05 90.35,13 U$5.8 91.75,11.9 92.3,12.45 94.05,12.45 94.59,11.9 | 90.4,13.05 Q7.2 | 90.4,13.05 90.05,13.4 C30.2 88.15,13.8 v87.7,14.25 | 94.59,11.9 94.6,11.9 | 94.59,11.9 94.6,11.85 94.6,8.3 M1.3 96.45,8.25 C17.2 96.85,7.9 v96.5,8.25 | v85.45,13.4 84.8,13.4 | 84.8,13.4 R36.2 | 84.8,13.4 84.15,13.4 83.65,13.1 83.65,9.9 v83.85,9.7 | v97.9,27.2 98.65,26.55 JP9.1 98.65,24.88 U$23.7 | 28,79.1 v29.5,78.4 | 28,79.1 v33.8,79.1 33.8,76.1 34.3,75.6 v35.5,75.6 | 28,79.1 26,80.2 26,81.1 26,85.5 v27.1,86.6 | v31.4,70.7 37,70.7 37.1,70.7 v36.2,69.4 35.7,68.5 R35.2 36.6,66.8 37,66.4 37,63.9 36.3,63.2 R37.2 v34.9,63.2 | U$22.2 36.77,52.47 36.1,51.8 30.8,51.8 30.5,52.1 30.5,54.8 31.6,55.9 v31.6,56 | v25.7,98 25.7,98.1 25.2,98.6 21.3,98.6 20.3,97.6 20.3,94.2 v20.1,94 | R4.2 25.8,97.9 | 11,67.8 11,73.4 11,80 11,80.5 10.2,80.5 9.4,81.3 R63.1 6.25,81.3 Q9.2 6.1,82.9 5.1,83.9 5.1,86 v5.6,86.5 | C16.2 27.1,89.8 v26.3,90.6 | C79.2 C80.2 92.65,42.05 U$28.5 95.25,41 96.9,41 98.27,39.63 BOOT2.2 | v94.6,64.9 94.26,65.24 U$25.VCC1 92.8,64.71 C69.2 | U$7.5 71.64,52.76 71.4,53 65.8,53 | 65.8,53 64.8,53 C33.2 | U$10.4 67.19,64.09 65.8,62.7 65.8,62.5 65.8,53
  Top 0.61: v14.4,69.1 12.3,69.1 11,67.8 6.5,67.8 L13.P$2 | v17.6,65.9 21.9,70.2 24.7,70.2 26.8,70.2 v28.9,72.3
  Dummy 0.254: 90.5,36.5 89.8,35.8 89.8,33.9 R75.2 88.4,29.3 v86.7,27.6
  Dummy 0.305: U$10.4 67.5,64.69 67.5,66.5 89,66.5 89,64.5 90.5,63 91.09,63 U$25.VCC1
  Dummy 0.406: U$8.1 78.69,10.69 78.1,10.1 62.4,10.1 61.69,9.39 58.19,9.39 47.5,0.5 10,0.5 8,2.5 8,10.7 v7.55,11.15 | U$23.7 88.02,14.25 v87.7,14.25 | 90.5,36.5 90.32,36.5 U$25.VCC
  Dummy 0.61: U$22.2 37,52.77 37,52 27,42 21.5,42 14.5,35 14.5,27.95 v15.05,27.4
  Bottom 0.254: v17.6,19.25 v18.9,19.25 | C24.1 17.25,25.2 v17.25,24.7 17.8,24.15 L12.1 | C22.1 14.75,18.45 v15.1,18.8 | v7.55,11.15 1.4,11.15 1,11.55 1,17.5 1.75,18.25 1.75,18.3 v1.7,18.35 | v83.85,9.7 82.49,9.7 U$8.1 | v97.9,27.2 97.7,27.4 97.6,27.4 | v86.7,27.6 86.7,27.9 | v20.1,94 20.1,94.2 | v21.1,90.1 20.9,90.2 | v25.6,92.5 25.6,92.6 | 33.8,79.9 C1.1 | v24.7,71.1 24.7,71.3 | v34.9,63.2 35,63.13 | R55.2 6.5,91.7 L5.1 5.3,91.5 4.5,90.7 R54.2 | C77.2 86,49.7 86.1,49.8 | v34.3,87.6 31.4,87.6 v30.6,88.4
  Bottom 0.305: v84.9,49.8 86.1,49.8 v88.6,49.8 | v92,54.5 v92,49 | C68.2 81.42,45.4 U$25.VCC | v47.6,63.2 47.6,59.1 v47.8,58.4
  Bottom 0.406: v15.1,18.8 12.7,18.8 v11.7,19.8 | v15.05,27.4 11.45,27.4 v10.4,26.35 | v87.7,14.25 87.7,13.9 87.2,13.4 v85.45,13.4 | v96.5,8.25 96.5,7.41 J2.2 | J5.2 97.6,33.3 C48.2 98.2,32.2 M3.3 98.2,28 97.6,27.4 97.3,27.1 L11.2 94.8,28.2 93.3,28.2 93,28.5 87.5,28.5 86.9,27.9 86.7,27.9 C50.2 | v33.8,79.1 33.8,79.9 | C3.1 25.1,70.7 v24.7,71.1 | v29.5,78.4 29.5,72.9 v28.9,72.3 29,72.2 29,71.8 29.8,71 29.8,70.9 30.3,70.4 31.1,70.4 v31.4,70.7 | C2.1 v36.2,69.4 | 35,63.13 JP1.2 31.6,59.73 v31.6,56 | v27.1,86.6 27.1,89.8 v26.3,90.6 26.3,91.8 v25.6,92.5 25.7,92.6 v25.7,98 | C4.1 27.2,80.9 v27,81.1 | v20.1,94 20,93.9 20,92.5 21,91.5 21,90.2 v21.1,90.1 | v5.6,86.5 4.7,87.4 R54.2 | L1.1 v35.5,75.6 | C76.2 88.7,49.9 v88.6,49.8 | v94.6,64.9 v94.6,57.3
  Bottom 0.61: v14.4,69.1 v17.6,65.9
  pour Top (no thermals): 3.9,70 3.9,68.5 4.5,67.9 4.5,67.5 7.3,67.5 7.3,70.9 6.4,70.9 6.3,70.8 6.3,68.4 6.1,68.2 5.3,68.2 5.2,68.3 5.2,70.1 4,70.1
+5V
  Top 0.406: USB2.P1 6.85,14.8 C40.2
  Top 0.61: L7.1 C40.2
+5V_FILT  (via drill 0.3)
  Top 0.406: Q10.2 8.65,7.85 v9.5,7 | v11.5,18.3 L7.2 10.55,18.85 9.9,19.5 3.5,19.5 3,20 3,20.5 | v13.75,16.45 13.75,13.6 | U3.1 3.6,22.6 | 3.6,22.6 3,22 3,20.5 | C43.1 3.7,22.7 3.6,22.6 | U3.3 3.2,20.7 3,20.5 | 13.75,13.6 v11.45,11.3 | 13.75,13.6 14,13.6 R64.2
  Bottom 0.406: v9.5,7 9.5,9.35 v11.45,11.3 | v11.5,18.3 11.9,18.3 v13.75,16.45
+15V  (via drill 0.3)
  Top 0.406: v28.8,1.9 28.8,1.85 27.85,0.9 18.25,0.9 17.65,1.5 17.65,2.7 C59.2 | v29.15,6.55 29.25,6.41 IC2.8
  Top 0.61: C57.1 20,8.5 D2.C 18.84,7.74 R73.2 17.8,4.85 C58.2 C59.2
  Bottom 0.406: v28.8,1.9 29.3,2.4 C9.1 29.3,5.3 C13.1 v29.15,6.55
A_MISO
  Top 0.254: U4.8 94.17,98.33 93.5,99 81.8,99 80.7,97.9 80.7,96.57 J6.1
A_MOSI
  Top 0.254: J6.4 93.7,94 94.17,93.53 U4.7
A_RESET
  Top 0.254: J6.5 80.76,91.46 82,92.7 85.7,92.7 86.2,93.2 90.1,93.2 90.36,92.94 U4.4
A_SCK
  Top 0.254: U4.9 92.91,98.09 92.5,98.5 82.7,98.5 82,97.8 82,95.27 J6.3
BOOT0  (via drill 0.3)
  Top 0.254: U$2.44 v20.75,19.15 | U$2.38 17.75,16.8 v17.65,16.7 17.6,16.65 14.55,16.65 13.65,17.55 v13.65,20.05 | v12.55,21.65 12.55,25.35 9.15,28.75 R43.2 4.32,28.75 BOOT1.1
  Bottom 0.254: v20.75,19.15 v17.65,16.7 | v12.55,21.65 13.1,20.9 v13.65,20.05
CA0
  Top 0.254: U$7.7 74.18,48.68 73.9,48.3 | 73.9,48.2 73.9,33.9 75.55,32.25 Q1.1 75.55,29.65 R7.1
  Top 0.305: 73.9,48.3 73.9,48.2
CA1
  Top 0.254: U$7.6 72.91,49.51 72.3,48.9 72.3,44.1 70.7,42.5 70.7,34.2 72.05,32.85 Q2.1 72.05,29.65 R11.1
CA2
  Top 0.254: U$7.4 70.37,48.63 70.7,48.3 70.7,44.5 69.4,43.2 69.4,42.1 68.7,41.4 68.7,31.8 68.55,31.65 Q3.1 68.55,29.65 R22.1
CA3  (via drill 0.3)
  Top 0.254: U$7.3 69.1,44.6 68,43.5 68,33.9 v67.4,33.3 | v64.9,33.1 65.05,32.95 Q5.1 65.05,29.65 R25.1
  Bottom 0.254: v64.9,33.1 67.2,33.1 v67.4,33.3
CC_RST  (via drill 0.3)
  Top 0.254: U1.39 29.14,75.76 31.4,73.5 33.6,73.5 33.9,73.2 35.2,73.2 35.4,73 v35.7,73 | v41.2,73 41.9,73 42.5,73.6 43.5,73.6 43.85,73.25 X1.22
  Bottom 0.254: v35.7,73 v41.2,73
CC_RX  (via drill 0.3)
  Top 0.254: U1.53 29.75,71.75 v29.9,71.9 | v42.9,70.2 43.2,70.2 43.75,70.75 X1.17
  Bottom 0.254: v29.9,71.9 31.7,71.9 32.7,70.9 42.2,70.9 v42.9,70.2
CC_SS  (via drill 0.3)
  Top 0.254: U1.40 28.95,75.25 31.2,73 33.4,73 33.8,72.6 v34.7,72.6 | v42.8,73 43.4,73 43.65,72.75 X1.21
  Bottom 0.254: v34.7,72.6 35.1,72.6 35.3,72.4 42.2,72.4 v42.8,73
CC_TX  (via drill 0.3)
  Top 0.254: U1.54 30.25,70.86 v30.5,71.2 | v41.7,70.2 42.3,70.8 43.2,70.8 43.65,71.25 X1.18
  Bottom 0.254: v30.5,71.2 30.7,71.4 31.6,71.4 32.6,70.4 41.5,70.4 v41.7,70.2
ESP_EN  (via drill 0.3)
  Top 0.254: U1.49 27.74,70.24 28.1,70.6 28.3,70.6 v28.7,71 | v21.8,79 21.7,79 19.9,80.8 12.1,80.8 v11.9,81
  Bottom 0.254: v28.7,71 28.8,71.3 27.6,72.5 27.6,76.7 28.1,77.2 28.1,77.8 26.9,79 v21.8,79 | v11.9,81 11.4,81 10,79.6 4,79.6 3.8,79.4 3.8,78.54 U2.3
ESP_IO0  (via drill 0.3)
  Top 0.254: U1.29 29.24,82.16 28.5,82.9 v28.5,83.6 | v20.7,76 20.9,76.1 22.2,76.1 22.4,76.3 22.4,81.7 v22.1,82
  Bottom 0.254: U2.25 17.8,62 19.2,62 20.7,63.5 v20.7,76 | v22.1,82 26.9,82 v28.5,83.6
ESP_MISO  (via drill 0.3)
  Top 0.254: R67.2 v23.3,65.5 22.3,65.5 21.6,64.8 v21.6,63.6 | v19,60.5 19,59 17,57 v15,57
  Bottom 0.254: v21.6,63.6 19,61 v19,60.5 | v15,57 11.2,57 10.19,58.01 U2.31
  Bottom 0.406: v23.3,65.5 R68.2
ESP_MOSI  (via drill 0.3)
  Top 0.254: R69.2 23.5,64.5 v22.5,64.5 | v20,60.5 20,59 v16.5,55.5
  Bottom 0.254: v20,60.5 20,61 22.5,63.5 v22.5,64.5 23.5,64.5 R70.2 | v16.5,55.5 11,55.5 7.5,59 3,59 2.57,59.43 U2.37
ESP_ON
  Top 0.305: R63.2 6.25,79.7 Q9.1
ESP_RX  (via drill 0.3)
  Top 0.254: v7,62.2 8,62.2 12.6,66.8 12.9,66.8 v13.8,67.7 | U1.51 28.76,68.36 28,67.6 22,67.6 18.4,64 v17.5,64
  Bottom 0.254: U2.34 6.38,61.58 v7,62.2 | v13.8,67.7 v17.5,64
ESP_SCK  (via drill 0.3)
  Top 0.254: v16,57.7 16,59 20,63 24.8,63 25.9,61.9 R66.2
  Bottom 0.254: U2.30 11.5,60.46 11.5,58.4 12.3,57.6 15.9,57.6 v16,57.7
ESP_TX  (via drill 0.3)
  Top 0.254: U1.52 29.24,68.14 28.2,67.1 22.2,67.1 18.4,63.3 v16.8,63.3 | v7.8,63 12.3,67.5 v12.6,67.5
  Bottom 0.254: U2.35 5.11,61.51 6.6,63 v7.8,63 | v12.6,67.5 v16.8,63.3
ESP_VCC  (via drill 0.3)
  Top 0.406: Q9.3 v2.6,80.5
  Bottom 0.406: v2.6,80.5 2.6,78.53 U2.2
F_MISO
  Top 0.254: 85.92,10.63 87.4,9.4 87.4,5.5 88.1,4.8 91.74,4.8
  Top 0.305: U$5.2 85.92,10.63 | 91.74,4.8 U$4.17
F_MOSI
  Top 0.254: U$4.16 92.38,4.17 92.6,4.4 92.6,7.85 92.3,8 91.55,8 U$5.5
F_NCS  (via drill 0.3)
  Top 0.254: U$4.10 87.22,0.93 v88.9,2.6 | U$5.1 87.19,11.9 87.85,11.4 87.85,6.95 v88.9,6.25
  Bottom 0.254: v88.9,6.25 v88.9,2.6
F_NHOLD  (via drill 0.3)
  Top 0.254: U$5.7 88.48,10.63 88.3,10.4 88.3,7.55 v88.5,7.3 | 85.1,7.1 v85.1,7.25 85.58,6.78 U$4.1
  Bottom 0.254: v88.5,7.3 85.15,7.3 v85.1,7.25
F_SCK  (via drill 0.3, 0.3 pad 0.25)
  Top 0.254: 90.36,9.35 U$5.6 90.33,9.35 89.05,9.35 88.75,9.05 88.75,7.9 89.5,7.15 v90.5,7.15 | U$4.15 91.08,3.52 90.5,4.1 v90.5,4.15
  Bottom 0.254: v90.5,4.15 v90.5,7.15
GND  (via drill 0.3, 0.3 pad 0.25)
  Top 0.254: U$4.7 86.92,2.88 v87.35,2.45 | C14.1 v83.05,5.95 | U$5.4 v83.81,8.1 v83.8,8.1 | C29.1 83.9,18.35 v83.85,18.4 | C30.1 v86.55,14.2 | U$19.15 84.75,28.66 v84.4,28.6 | U1.12 36.05,76.75 v35.9,76.6 | IC4.3 3.75,67.05 IC4.EXP | IC4.EXP 3.6,66.7 3.6,66.1 3.65,66.05 IC4.1 4.45,64.35 C51.1 | IC4.6 3.25,67.05 IC4.EXP | U1.31 28.25,81.65 v27.8,81.9 | U1.18 34.75,81.65 v34.6,81.8 | U1.47 27.05,71.75 v27.1,71.8 | C21.1 C23.1 v26.3,87.7 26.4,87.8 C16.1 v28.3,87.8 | C11.1 v18.5,89 | C15.1 v28.1,93.4 | C8.1 v19.3,96.6 | v21.7,91.8 21.8,91.8 IC1.P | U$29.15 88.78,49.17 v88.4,48.8 | R82.1 91,40 v90.9,40.1
  Top 0.305: U1.63 34.75,68.35 v35,68.1 | X1.4 47.55,64.25 v47.6,64.2 | X1.11 47.4,67.75 v47.4,67.7 | X1.29 47.9,76.75 v47.9,76.7 | X1.31 47.9,77.75 v47.9,77.8 | X1.33 47.9,78.75 v47.9,78.7 | X1.35 47.9,79.75 v47.9,79.7 | X1.37 47.9,80.75 v47.9,80.8 | X1.40 47.9,82.25 v47.9,82.2 | X1.5 47.15,64.75 v47.6,65.2 | X2.4 57.25,71.15 v57.2,71.1 | X2.5 57.75,71.25 v57.9,71.1 | X2.11 60.75,71.15 v60.8,71.1 | X2.29 69.75,71.25 v69.7,71.1 | X2.31 70.75,71.15 v70.7,71.1 | X2.33 71.75,71.15 v71.8,71.1 | X2.35 72.75,71.15 v72.8,71.1 | X2.37 73.75,71.15 v73.8,71.1 | X2.40 75.25,71.15 v75.3,71.1
  Top 0.406: JP3.1 94.9,2 94.15,2.75 C5.1 | M1.1 v93.8,7.1 | C17.1 v98.85,8.7 | C37.1 v98.6,12.65 | C36.1 v96.7,12.7 | Q8.2 91.55,17.05 v92.1,16.5 | C10.1 v83,1.15 | C62.1 v1.5,69.3 | C64.1 C65.1 8.4,69.2 v9.2,69.2 | S1.P$1 v1.4,76.5 | USB1.P5 12.8,56.1 12.9,56.2 13.2,56.2 v13.4,56.3 | v95.9,43 U$28.2 97.4,43 98.4,44 C78.1 | USB3.P5 94.5,51.8 v94.2,52.1 | C69.1 91.2,64.83 U$25.GND1 | C80.1 C79.1 v91,44.6 | S3.P$2 96.25,56.35 v96.2,56.4 | M2.1 70.05,25.55 J1.2 | 59.6,58.26 v59.7,58.3 | IC9.2 v74.99,94.21 v75,94.2 | C71.1 74.43,91.93 v74.5,91.9 | C74.1 74.43,90.33 v74.5,90.4
  Top 0.61: U$14.2 59.6,58.26 | R72.1 v61,60.6 | C54.1 60.5,62.34 v60.5,63.2 | C55.1 57.3,62.36 v57.3,63.4 | C42.1 v59.7,54 | IC8.12 66.14,94.24 v65.9,94 | C67.1 77.38,93.08 v77.4,93.1
  Dummy 0.152: v78,89.4 79.8,89.4 v82.5,86.7
  Dummy 0.254: 95,37 96.9,37 97.4,36.5 97.4,34 v99.4,32
  Dummy 0.305: 90.68,65.35 90.68,67.18 v91,67.5 | v77.5,35.2 77.9,35.2 79.6,36.9 81.3,36.9 82,37.6 v82,38.6
  Dummy 0.406: U$8.4 75.24,17.41 | 75.24,17.41 61.65,17.7 61.65,17.65 TP11.TP | U$23.8 99.36,21.36 99.5,21.5 99.5,16 98.6,15.1 v98.6,12.65 | 90.68,65.35 U$25.GND1 | 95,37 94,37 v90.9,40.1 | 75.24,17.41 75.24,20.49 v76.3,21.55 | v48.8,82.2 53.87,82.2 U$18.1
  Dummy 0.61: P1.1 14,55.7 v13.4,56.3 | v64.1,60.4 61,60.4 v61,60.6
  Bottom 0.254: v87.35,2.45 87.35,2.55 | v83.05,5.95 83.05,6 | v83.8,8.1 83.9,8.1 | v83.85,18.4 83.8,18.4 83.75,18.35 | v86.55,14.2 86.55,14.25 86.5,14.3 | v84.4,28.6 84.3,28.5 | v35.9,76.6 35.9,76.8 | v27.8,81.9 28.1,81.9 | v34.6,81.8 34.4,81.8 | v27.1,71.8 27.3,71.8 | v26.3,87.7 26.1,87.7 | v18.5,89 18.8,89 | v28.3,87.8 28.3,87.7 | v28.1,93.4 28.1,93.1 | v19.3,96.6 19.3,96.3 | v88.4,48.8 88.4,48.7 | v90.9,40.1 91.1,40.1
  Bottom 0.305: v35,68.1 35.2,68.1 | v47.6,64.2 47.7,64.3 | v47.4,67.7 47.5,67.7 | v47.9,76.7 48.1,76.7 | v47.9,77.8 48,77.8 | v47.9,78.7 48.1,78.7 | v47.9,79.7 48.2,79.7 | v47.9,80.8 48.1,80.8 | v47.9,82.2 v48.8,82.2 | v47.6,65.2 47.8,65.2 | v57.2,71.1 57.3,71 | v57.9,71.1 58.1,71.1 | v60.8,71.1 60.8,71 | v69.7,71.1 69.8,71.2 70.3,70.7 | v70.7,71.1 70.7,70.9 70.8,70.8 | v71.8,71.1 71.7,70.9 | v72.8,71.1 72.9,71 | v73.8,71.1 73.8,70.7 | v75.3,71.1 75.1,70.9
  Bottom 0.406: v93.8,7.1 94.05,7.85 94.1,7.9 | v98.6,12.65 98.6,13.2 | v96.7,12.7 96.7,12.85 | v92.1,16.5 92,16.5 91.75,16.75 | v83,1.15 83.15,1.15 83.2,1.1 | v1.5,69.3 1.6,69.3 | v9.2,69.2 9.5,69.2 | v1.4,76.5 1.6,76.5 | v13.4,56.3 13.4,56.4 | v95.9,43 96.2,43 | v94.2,52.1 94.2,52.3 | v91,44.6 91,44.4 | v96.2,56.4 96.3,56.5 | v59.7,58.3 59.8,58.3 59.8,58.2 | v75,94.2 74.8,94.2 | v74.5,91.9 74.3,92 | v74.5,90.4 74.4,90.4
  Bottom 0.61: v61,60.6 60.8,60.6 60.8,60.7 | v60.5,63.2 60.4,63.2 60.4,62.9 | v57.3,63.4 57.4,63.4 57.4,63 | v59.7,54 59.4,54 | v65.9,94 65.6,94 | v77.4,93.1 77.2,93.1
  other vias: 13.5,5.5 14.45,5.5 22.25,16.9 25.45,22.95 17.55,27.35 17.05,19.85 11.8,16.15 11.85,16.9 10.35,20.25 30.7,13.35 30.75,11.85 38.75,12.65 54.1,20.8 54.05,17.3 53.9,28.05 46.9,28.05 43.9,28.05 54.9,28.05 45.99,46.15 44.69,41.85 47.19,41.75 42.9,28.05 42.9,27.05 43.9,27.05 42.9,24.95 42.9,24.05 42.9,23.05 43.6,22.35 42.9,20.75 42.9,19.75 42.9,18.75 42.9,14.55 42.9,13.55 42.9,12.55 42.9,11.55 42.9,10.55 42.9,9.55 42.9,8.55 42.9,7.55 42.9,5.55 42.9,4.55 42.9,3.55 42.9,2.55 42.9,1.55 47.7,27.25 49.9,27.15 49.9,28.05 50.9,28.05 51.9,28.05 53.9,27.25 56.4,29.55 59.9,27.65 61.5,27.65 60.7,27.65 61.5,28.55 61.5,25.65 61.5,26.65 27.15,17.8 14.75,14.95 21.9,36.05 24.9,29.55 29.4,27.55 29.1,20.75 31.15,20.7 34.5,23.9 35.8,19.9 37.15,26.4 37.75,25.05 25.75,12.35 22.7,12.4 29.25,8.25 18.85,23.1 20.2,20.55 18.95,20.85 21.15,23.2 5.7,21.65 7.15,21.65 8.55,20.2 5.05,25.3 5.4,27.15 7.6,27.15 6.5,26 3.95,30.5 6.7,30.5 8.75,25.95 13.4,33.35 20,5.95 14.85,2.5 16,2.35 19.7,1.6 21.35,1.85 21.25,5.55 21.15,6.95 18.9,6.45 35.4,1.65 36.4,2.7 37.2,3 37.2,5.2 40.55,3.85 39.4,2.7 38.35,3.8 26.4,10.05 24.5,10.75 41.3,9.15 40.25,8.1 41.2,11.65 89.85,1.5 94.2,2.95 88.55,11.9 93.1,13.25 6.85,12.6 6.85,11.85 7.55,12.25 99.3,28.1 87,30.1 86.7,28.9 96.7,26.2 97.6,26.2 92.6,24.7 92.7,23.9 92.6,26 92.4,26.9 21.7,93.3 3.5,67.2 3.5,66.4 9.6,91.4 9.6,90.5 9.6,89.6 5.4,90.2 5.4,89.4 5.4,88.6 23.3,93.3 23.3,91.8 9.9,86 10.6,85.2 11.3,84.4 12.9,81.6 14.9,81.6 17,81.6 19,81.6 19,83.7 19.1,85.9 17.8,73.3 17.7,72.5 17.2,71.1 13,70.4 30.6,77.5 31.3,78.3 31.7,76.5 36.4,80 14.1,56.3 8,53.8 8.2,56.7 5.7,58.4 2.8,57.9 3.2,62.8 11.3,62.8 7.6,93.4 2.6,88.4 2.6,92.4 5.1,97.9 36.3,93.9 29.1,92.6 35.7,83.2 39.6,91.3 38.2,92.4 37.3,68.3 39.5,64.9 40.5,63.2 36.8,60.3 35.2,56 39.8,56 38.4,90.5 9.4,70.5 2.5,70.6 5.6,64.3 21.5,72.9 22.7,71.5 17.5,80 19.4,79.1 38.5,77 40.1,77 39.5,97.5 40.6,89.5 8,66.9 56.95,9.4 55.65,10.3 54.35,11.2 46.25,15.1 47.35,16.1 38.8,15.95 61.15,7.4 61.25,11.5 94,46.6 98.6,45.1 92.4,58.8 91.1,55 89.3,55 90.7,59.2 93.7,62.2 95.4,63.9 95.6,62.1 87.5,53.9 83.4,54.7 81.9,49.7 82.7,42.7 86.1,59 84.8,59 82.6,47.6 87.6,52 94,38.1 94.5,40.6 89.5,45.6 90,38.1 93.8,43 91.1,48.3 93.3,69.2 92.3,67.5 91,70.8 92.3,70.8 82.9,79.9 82.4,78.9 85,84.7 83.9,85.7 96.8,81.8 95.9,80.2 94.6,80.1 85.6,97 86.3,89.3 82.5,85.7 83.9,86.5 89.4,85.7 92.1,85.2 71.4,26.25 74.9,23.55 64.7,55.9 65.1,60.4 66.6,60.4 67.6,60.4 68.6,60.4 69.6,60.4 71.1,60.4 72.1,60.4 73.6,60.4 74.6,60.4 75.6,60.4 76.6,60.4 77.6,60.4 71.6,54.9 70.8,54.9 72.4,54.9 71.6,58.3 65,35.1 67,34.8 69.7,36.1 75.1,35.6 69.6,38.2 66.5,38.4 66.5,41 66.5,43.5 65,65.6 63.9,64.4 54.19,31.75 35.3,78.9 31.1,94.8 39.5,80.3 42.6,77.6 77.7,96.5 61.1,93.1 53.9,93.1 64.9,93.9 65.2,92.8 86.5,94.9
  pour Bottom: 0.5,50 62.5,49 63,0 -0.5,0
  pour Top: -0.5,0 63,0 62.5,49.5 0,50
  pour Bottom: 79.5,20 100,20 100,0 79.5,0
  pour Top: 100,20 79.5,20 79.5,0 100,0
  pour Bottom: 79.5,36.5 100,36.5 100,21 79.5,21
  pour Top: 79.5,21 100,21 100,36.5 79.5,36.5
  pour Bottom (rank 2): 0,100 51.5,100 51.5,50 0,50
  pour Top (rank 2): 0,100 51.5,100 51.5,50 0,50
  pour Bottom: 79.5,37.5 79.5,66 100,66 100,37.5
  pour Top: 79.5,37.5 79.5,66 100,66 100,37.5
  pour Bottom: 79.5,67 79.5,100 100,100 100,67
  pour Top: 79.5,67 100,67 100,100 79.5,100
  pour Bottom: 63.5,27.5 78.5,27.5 78.5,21 63.5,21
  pour Top: 63.5,27.5 78.5,27.5 78.5,21 63.5,21
  pour Bottom: 63,66.5 78.5,66.5 78.5,28 63,28
  pour Top: 63,66.5 78.5,66.5 78.5,28 63,28
  pour Bottom: 52.5,66.5 52.5,86 78.5,86 78.5,66.5
  pour Top: 52,86 79,86 79,66.5 52,66.5
  pour Bottom: 52.5,66.5 63,66.5 63,50 52,50 52,66.5
  pour Top (rank 2): 52.5,50.5 52.5,66 62.5,66 62.5,50.5
  pour Top: 52.5,100 52.5,87 78.5,87 78.5,100
  pour Bottom: 52.5,100 78.5,100 78.5,87 52.5,87
LCLK
  Top 0.305: U$7.11 72.91,64.36 U$10.2
LDAT
  Top 0.254: U$7.13 70.37,63.86 U$10.3
LED0  (via drill 0.3)
  Top 0.254: U$2.2 24.95,19.75 v25.6,19.1 | v26.7,30.55 26.7,30.8 25,32.5 R2.2
  Bottom 0.254: v25.6,19.1 25.6,19.2 26.75,20.35 26.75,30.45 v26.7,30.55
LED1  (via drill 0.3)
  Top 0.254: U$2.3 25.45,20.25 v26.5,19.2 | v27.3,31.05 27.3,31.9 R5.2
  Bottom 0.254: v26.5,19.2 27.25,19.95 27.3,28.85 v27.3,31.05
LED2  (via drill 0.3)
  Top 0.254: U$2.4 25.85,20.75 v26.15,20.6 | v25.5,30.75 25.1,31.1 R9.2
  Bottom 0.254: v26.15,20.6 26.15,30.1 v25.5,30.75
MCO
  Top 0.254: U1.41 24.75,74.75 22.9,76.6 R40.1
MCU_MISO  (via drill 0.3)
  Top 0.254: R59.1 R60.1
  Top 0.305: v39.95,27.5 v39.95,18.85
  Top 0.406: U$20.7 56.63,10.5 | 56.63,10.5 56.63,10.13 55.75,9.25 46.25,9.25 45.5,10 45.5,15.3 44.05,16.75 v39.95,16.75 R60.1 | 56.65,10.5 56.63,10.5 | IC5.7 51.04,34.05 49.9,32.9 49.5,32.9 | 49.5,32.9 40.45,32.9 v39.95,32.4 | U$13.3 52.65,27.15 v52.6,27.2 | v49.3,33 49.3,33.1 49.5,32.9
  Bottom 0.305: v39.95,32.4 v39.95,27.5 | v39.95,18.85 v39.95,16.75
  Bottom 0.406: v52.6,27.2 52.6,29.8 v49.3,33
MCU_MOSI  (via drill 0.3)
  Top 0.406: 56.63,21.6 U$20.10 56.63,18.17 | 56.63,21.6 56.63,21.62 v56.4,21.85 | v56.4,21.85 56.63,21.6 | R62.1 R61.1 55.4,29.1 56.5,28 v56.5,27.9 56.5,23.7 | 56.5,23.7 56.5,21.95 v56.4,21.85 | IC5.10 51.04,42.65 54.99,38.7 54.99,33.5 v57.2,31.9 | U$13.1 56.4,23.8 56.5,23.7
  Bottom 0.406: v57.2,31.9 57.2,28.9 v56.5,27.9
MCU_PA0  (via drill 0.3)
  Top 0.406: U$20.11 v55.36,21.14 55.25,21.25 | 55.25,21.25 55,21.5 v47,21.5 | v55.35,21.15 55.5,21.15 55.25,21.25 | R56.1 36.65,27.55 37.5,28.4 41.7,28.4 42,28.1 42,22 42.5,21.5 v44.5,21.5 | IC5.11 48.5,44.41 49.64,45.55 | 49.64,45.55 50.19,46.1 54.3,46.1 55.2,45.2 55.2,44.3 58.7,40.8 59.1,40.39 59.1,24.6 v59.8,23.9 | TP28.TP 49.64,45.55
  Bottom 0.406: v55.35,21.15 59.6,21.15 59.8,21.35 v59.8,23.9 | v47,21.5 v44.5,21.5
MCU_PA7  (via drill 0.3)
  Top 0.305: v38.6,27.5 38.6,18
  Top 0.406: U$20.6 55.36,11.25 | 55.36,11.25 55.36,11.11 54.75,10.5 47.5,10.5 47,11 47,15.5 44.5,18 38.6,18 36.8,18 R57.1 | 55.35,11.25 55.36,11.25 | IC5.6 48.5,34.51 48.09,34.1 39.74,34.1 v38.6,32.95 37.75,33.8 32.4,33.8 31.69,34.51 TP29.TP
  Bottom 0.305: v38.6,32.95 v38.6,27.5
MCU_SCK  (via drill 0.3)
  Top 0.406: R58.1 36.3,32.2 38.1,30.4 48.5,30.4 | 48.5,30.4 57.9,30.4 | U$20.9 57.9,30.4 | IC5.9 56.19,41.2 57.9,39.5 57.9,30.4 | U$13.6 48.9,23.8 v48.5,23.4 | v48.5,30.5 48.5,30.4
  Bottom 0.406: v48.5,23.4 v48.5,30.5
MISO  (via drill 0.3)
  Top 0.254: U$2.40 18.75,16.35 20.15,14.95 32.5,14.95 | 32.5,14.95 35.15,14.95 R59.2 | R62.2 33.65,30.65 32.5,29.5 v32.5,17.2 | v32.5,14.75 32.5,14.95
  Bottom 0.254: v32.5,17.2 v32.5,14.75
MOSI
  Top 0.254: U$2.41 19.25,16.45 20.3,15.4 32.69,15.4 33.1,15.81 33.1,16.7 | R61.2 33.7,29.1 32.95,28.35 32.95,17.6 33.1,17.45 33.1,16.7 | R60.2 33.15,16.75 33.1,16.7
N$1
  Top 0.254: LED2.C R5.1
N$2
  Top 0.406: 10.85,4.35 12,4.35 U$15.4 U$15.5
  Top 0.813: C44.2 10.85,3.3 10.85,4.35 Q10.3 12,9.1 L10.P$1
N$3
  Top 0.254: LED3.C R9.1
N$4
  Top 0.406: L2.2 98.1,6.05 M1.2
N$5
  Top 0.406: C5.2 98.3,4.35 L2.1 98.15,2.12 JP3.2
  Bottom 0.406: J2.1 98.15,2.12 JP3.2
N$6  (via drill 0.3 pad 0.25)
  Top 0.254: U$4.5 85.38,4.17 v85.1,4
  Bottom 0.254: v85.1,4 85.5,4 TP17.TP
N$7
  Top 0.305: U$4.8 85.12,2.23 84.7,2.65 84.7,3.5 C14.2
N$8  (via drill 0.3)
  Top 0.254: U$4.4 v85.12,4.83 | U$8.2 81.52,13.23 82.6,12.15 82.6,9.25 v82.45,9.1 | v83.65,15.15 R36.1 C29.2
  Bottom 0.254: v82.45,9.1 82.45,5.65 82.75,5.35 83.95,5.35 84.4,4.9 85.05,4.9 v85.12,4.83 | v83.65,15.15 83.42,15.15 U$8.2
N$9  (via drill 0.3 pad 0.25)
  Top 0.254: U$4.6 86.78,3.52 v87.15,3.85
  Bottom 0.254: v87.15,3.85 87.15,4.15 TP18.TP
N$10  (via drill 0.3 pad 0.3)
  Top 0.305: U$19.5 92.39,28 v92.4,27.8
  Bottom 0.305: v92.4,27.8 92.4,27.6 L11.1
  Bottom 0.406: C45.2 C46.2 91.6,27.8 v92.4,27.8
N$11
  Top 0.406: JP6.1 94.8,17.07 L6.2 96.2,15.55 C36.2
N$12
  Top 0.254: TP14.TP 91.8,6.81 U$4.20
N$13
  Bottom 0.406: L8.1 94,31.4 J4.1 | J5.1 93.94,32.44 J4.1 | C41.2 93.1,33.1 93.8,32.4 93.8,31.6 J4.1
N$14
  Top 0.406: JP6.2 98.27,15.88 C37.2
N$15
  Top 0.406: Q8.3 Q7.3 94.05,13.55 L6.1
N$16
  Bottom 0.406: M3.2 L8.2
N$17
  Top 0.406: USB3.P1 94.2,49.2 L14.1
N$18
  Top 0.406: Q7.1 89.45,15.45 R50.1 89.3,15.6 R49.1
N$19
  Top 0.406: Q8.1 89.35,18.95 R51.1
N$20
  Top 0.254: USB1.P2 10.85,57.05 R12.1
N$21
  Top 0.254: LED1.C R2.1
N$22
  Top 0.254: USB1.P3 11.5,56.5 12.2,57.2 R14.1
N$23
  Top 0.254: JP9.2 94.68,26.33 R76.2 93,25.41 U$19.1
N$24
  Top 0.305: X2.1 53.55,72.25 52.7,73.1 52.7,83.21 U$12.1
N$25  (via drill 0.3)
  Top 0.254: v15,58.7 15,62.5 17.2,64.7 18.4,64.7 22.1,68.4 R65.2
  Bottom 0.254: U2.29 12.73,59.27 13.3,58.7 13.6,58.7 v15,58.7
N$26
  Top 0.254: LED4.C R38.1
N$27
  Top 0.254: LED5.C R42.1
N$28
  Top 0.254: LED6.C R45.1
N$29
  Top 0.406: USB3.P2 92.95,49.85 R78.1
N$30
  Top 0.406: TP23.TP 35.89,43.9 IC5.16
N$31
  Top 0.406: TP22.TP 38.39,43.86 IC5.15
N$32
  Top 0.406: TP21.TP IC5.14
N$33
  Top 0.406: USB3.P3 94.5,50.5 93.5,51.5 R79.1
N$34  (via drill 0.3)
  Top 0.305: IC7.3 89.52,80.31 v89,79.9 | v87.7,72.5 86.8,72.5 85.94,71.64 IC6.3
  Bottom 0.305: v89,79.9 87.7,78.6 v87.7,72.5
N$35
  Top 0.406: TP20.TP 43.39,43.84 IC5.13
N$36
  Top 0.406: USB2.P2 8.35,14.15 R47.1
N$37
  Top 0.406: USB2.P3 8.2,13.5 R48.1
N$38
  Top 0.305: IC6.4 87.22,67.61 87.1,67.5 81.69,67.5 JP12.1
N$39
  Top 0.406: USB1.P1 10.2,56.3 8.8,57.7 L4.1
N$40  (via drill 0.3)
  Top 0.254: IC1.24 19.65,91.25 v19.6,91.1
  Bottom 0.406: v19.6,91.1 R30.2
N$41
  Top 0.406: L3.1 70.4,22.1 J1.1
  Bottom 0.406: C6.2 J1.1
N$42  (via drill 0.3)
  Top 0.305: R74.2 16,6.5 R73.1 16.05,6.85 v15.3,6.85 | U$15.3 v12.55,5.85
  Bottom 0.305: v12.55,5.85 12.55,6.7 12.7,6.85 v15.3,6.85
N$43
  Top 0.305: C63.2 22.9,10.15 D3.K D4.A
N$44
  Bottom 0.254: C35.1 13.22,90.5 T1.5
N$45  (via drill 0.3)
  Bottom 0.254: v15.8,84.4 14.9,84.4 C34.1 15.3,86 15.3,90.3 16.14,91.14 16.34,91.14
  Bottom 0.406: 16.34,91.14 T1.4
N$46
  Bottom 0.254: T1.12 2.67,83.88 R54.1
N$47
  Top 0.406: M2.2 73.55,23.65 74.7,22.5 L3.2
N$48  (via drill 0.3)
  Top 0.406: JP5.1 77.2,22.8 M2.3 74.9,24.7 v75.7,25.6
  Bottom 0.406: v75.7,25.6 C18.2
N$49
  Top 0.305: JP13.8 90.94,86.36 90.8,86.5 90.8,87.91 IC7.13
N$50
  Top 0.406: IC2.6 35.02,3.87 R29.2 35.15,4.25 35.15,5.4 R28.2
N$51
  Top 0.305: IC2.2 23.64,5.13 R27.2 22.95,5 22.25,5.7 R26.2
N$52
  Top 0.305: JP12.8 81.9,85.06 81.9,83.9 87.22,78.58 IC6.13
N$53
  Bottom 0.254: T1.9 2.67,97.12 R55.1
N$54
  Top 0.406: TP24.TP 33.89,38.1 IC5.1
N$55
  Top 0.406: TP25.TP 32.19,40.1 32.99,39.3 35.23,39.3 IC5.2
N$56
  Bottom 0.254: R41.2 12.2,97.3 10.7,95.8 R39.2 R44.2 9.5,92.5 L5.2 8.3,91.3 C28.2 9.3,88.5 R46.2
N$57
  Top 0.406: TP26.TP 32.09,42.6 34.19,40.5 36.57,40.5 IC5.3
N$58
  Top 0.254: IC1.6 23.75,89.55 C21.2 C23.2
N$59
  Top 0.406: TP27.TP 33.09,44.6 33.69,44 33.69,43 34.89,41.8 37.81,41.8 IC5.4
N$60
  Top 0.305: JP12.7 80.92,83.5 81.5,83.5 85.94,79.06 IC6.14
N$61
  Top 0.305: IC6.12 88.48,73.89 88.1,73.5 82.9,73.5 82.3,74.1 82.3,77.05 JP12.5
N$62  (via drill 0.3)
  Top 0.305: IC6.1 82.78,69.12 v82.5,69.4
  Bottom 0.305: v82.5,69.4 82.5,74.31 JP12.4
N$63  (via drill 0.3)
  Top 0.305: JP12.3 80.64,73.16 81.6,72.2 v85.2,72.2 | v86.9,71.3 88.2,71.3 88.5,71 88.5,69.13 IC6.5
  Bottom 0.305: v85.2,72.2 86,72.2 v86.9,71.3
N$64
  Top 0.305: IC6.2 84.67,70.53 84.1,71.1 80.67,71.1 JP12.2
N$65  (via drill 0.3)
  Top 0.254: v73.3,42.5 73,42.2 Q2.3
  Bottom 0.254: U$3.9 76.8,44.5 75,42.7 73.5,42.7 v73.3,42.5
N$66
  Top 0.305: J6.2 84.46,96.54 SJ1.2
N$67
  Top 0.305: 98.38,83.82 JP13.7 98.41,83.8 98.3,83.9 97.28,84.92 93.48,84.92 92.5,85.9 90.1,85.9 89.5,86.5 89.5,87.91 IC7.14
N$68
  Top 0.305: JP13.6 98.42,81.38 96.2,83.9 89.1,83.9 88.25,84.75 IC7.15
N$69  (via drill 0.3)
  Top 0.305: JP13.5 98.42,79.33 99.5,80.5 99.5,84.7 99.1,85.1 97.9,85.1 97.4,85.6 v93.7,85.6 | 92.1,89.5 v92,89.4 92.06,89.45 IC7.12
  Bottom 0.305: v93.7,85.6 93.7,87.7 v92,89.4
N$70
  Top 0.305: IC6.15 84.67,79.42 82.9,81.2 80.69,81.2 JP12.6
N$71  (via drill 0.3)
  Top 0.305: IC7.1 86.97,79.62 88,78.6 91,78.6 93.7,75.9 93.7,75.3 v94,75 | v95.7,76.5 98.12,76.5 JP13.4
  Bottom 0.305: v94,75 94.2,75 v95.7,76.5
N$72
  Top 0.305: IC7.5 92.06,79.64 94.2,77.5 99,77.5 99.5,77 99.5,75 98.42,73.92 JP13.3
N$73
  Top 0.305: IC7.2 88.25,79.45 88.6,79.1 91.2,79.1 96.7,73.6 96.7,72.84 JP13.2
N$74
  Top 0.305: IC7.4 90.78,80.22 97.3,73.7 97.3,72.9 97.8,72.4 98.9,72.4 99.5,71.7 99.5,69.75 JP13.1
N$75  (via drill 0.3)
  Top 0.254: Q3.3 69.5,34.4 v70.1,35 | v71.5,35 71.6,35 72,35.4 v72,41.7
  Bottom 0.254: U$3.8 75.41,47.31 72,43.9 v72,41.7 | v70.1,35 v71.5,35
N$76
  Top 0.305: Q1.3 76.5,36.85 U$3.12
N$77  (via drill 0.3)
  Top 0.254: Q5.3 66,35 67.5,36.5 v67.5,48.55
  Bottom 0.254: v67.5,48.55 66.5,48.55 U$3.6
N$78  (via drill 0.3)
  Top 0.152: 55.4,83.37 U$12.2